# Altium project PPC_notebook_electrical_schematics_v0.6.PrjPcb (part 2 of 10)

## Sheet 07 SYS.SchDoc
size 420 x 297 mm
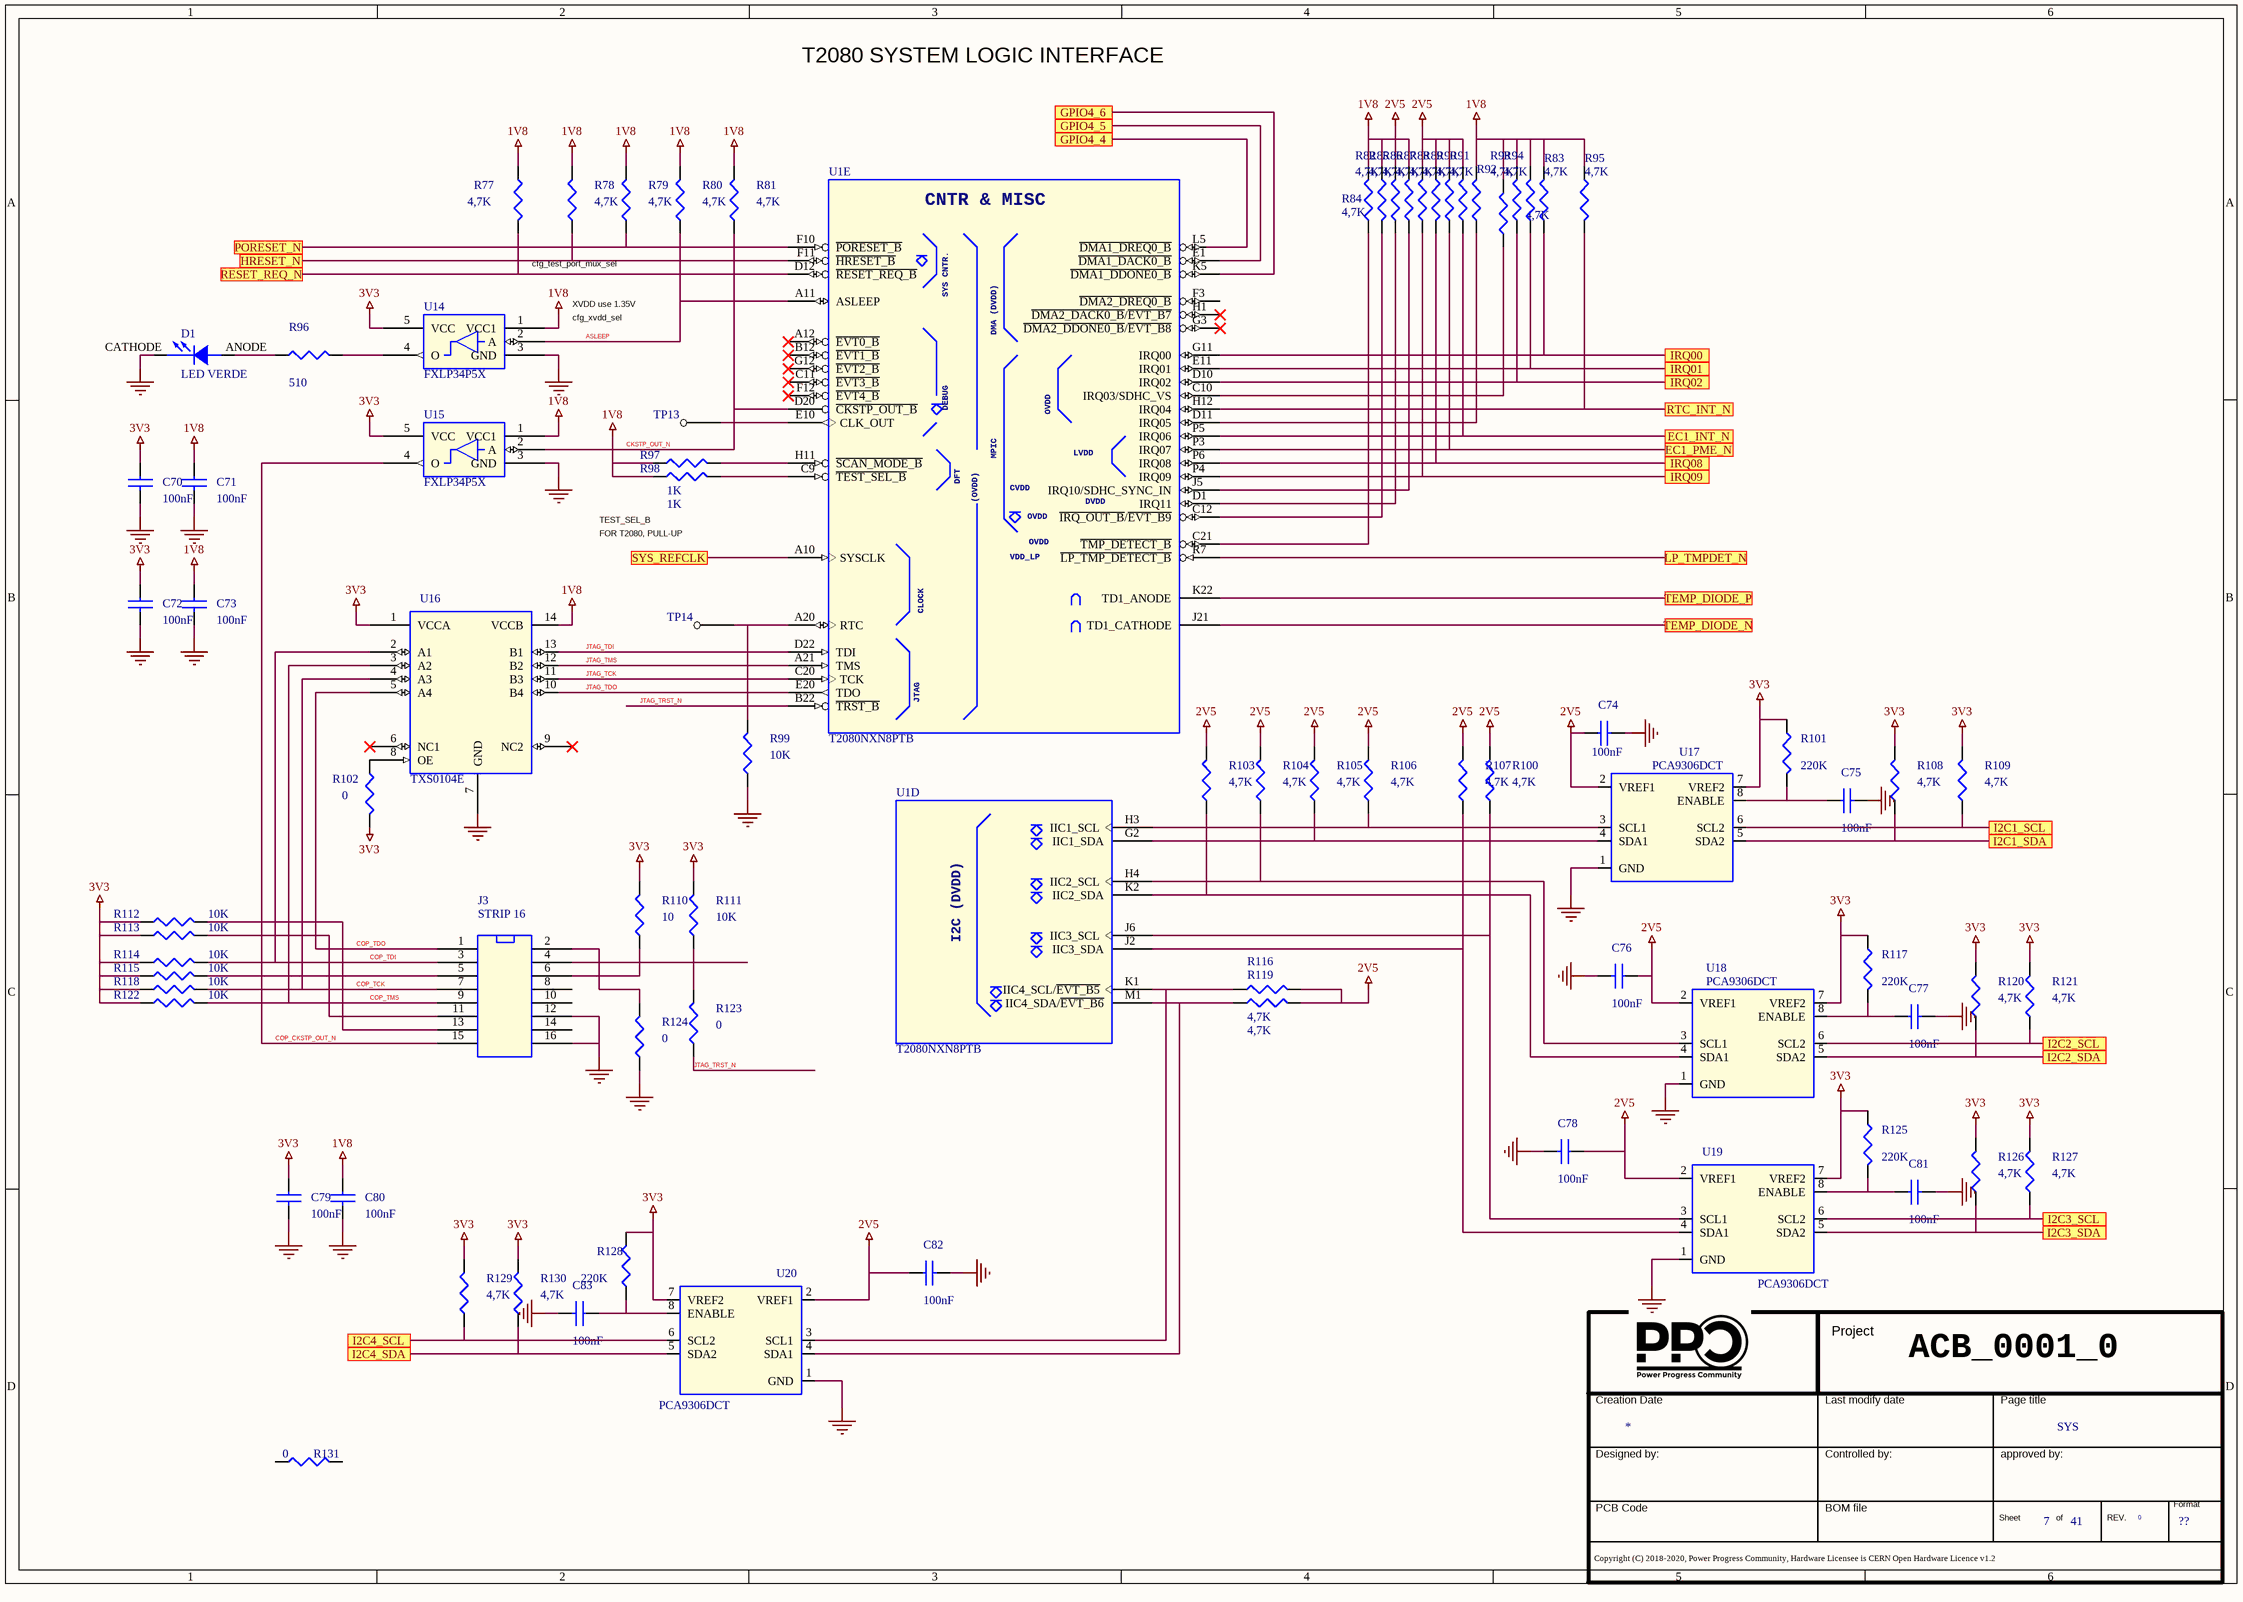
[diagram p15: 07 SYS.SchDoc]

### Parts
(Parts that share a designator on the sheet are numbered #1, #2 ... from top to bottom, then left to right.)
*#8  Doc: SYS  Page Count: 41  Page Number: 7  Page Size: ??  RevCode: 0  (hidden comment: Title_block_PPC)  (graphical)
C70  100nF  [SMD_0402]
C71  100nF  [SMD_0402]
C72  100nF  [SMD_0402]
C73  100nF  [SMD_0402]
C74  100nF  [SMD_0402]
C75  100nF  [SMD_0402]
C76  100nF  [SMD_0402]
C77  100nF  [SMD_0402]
C78  100nF  [SMD_0402]
C79  100nF  [SMD_0402]
C80  100nF  [SMD_0402]
C81  100nF  [SMD_0402]
C82  100nF  [SMD_0402]
C83  100nF  [SMD_0402]
D1  LED VERDE  [led_0603]
J3  STRIP 16  [SMD_2X50_P=0.635mm]
R77  4,7K  [SMD_0402]
R78  4,7K  [SMD_0402]
R79  4,7K  [SMD_0402]
R80  4,7K  [SMD_0402]
R81  4,7K  [SMD_0402]
R82  4,7K  [SMD_0402]
R83  4,7K  [SMD_0402]
R84  4,7K  [SMD_0402]
R85  4,7K  [SMD_0402]
R86  4,7K  [SMD_0402]
R87  4,7K  [SMD_0402]
R88  4,7K  [SMD_0402]
R89  4,7K  [SMD_0402]
R90  4,7K  [SMD_0402]
R91  4,7K  [SMD_0402]
R92  4,7K  [SMD_0402]
R93  4,7K  [SMD_0402]
R94  4,7K  [SMD_0402]
R95  4,7K  [SMD_0402]
R96  510  [SMD_0402]
R97  1K  [SMD_0402]
R98  1K  [SMD_0402]
R99  10K  [SMD_0402]
R100  4,7K  [SMD_0402]
R101  220K  [SMD_0402]
R102  0  [SMD_0402]
R103  4,7K  [SMD_0402]
R104  4,7K  [SMD_0402]
R105  4,7K  [SMD_0402]
R106  4,7K  [SMD_0402]
R107  4,7K  [SMD_0402]
R108  4,7K  [SMD_0402]
R109  4,7K  [SMD_0402]
R110  10  [SMD_0402]
R111  10K  [SMD_0402]
R112  10K  [SMD_0402]
R113  10K  [SMD_0402]
R114  10K  [SMD_0402]
R115  10K  [SMD_0402]
R116  4,7K  [SMD_0402]
R117  220K  [SMD_0402]
R118  10K  [SMD_0402]
R119  4,7K  [SMD_0402]
R120  4,7K  [SMD_0402]
R121  4,7K  [SMD_0402]
R122  10K  [SMD_0402]
R123  0  [SMD_0402]
R124  0  [SMD_0402]
R125  220K  [SMD_0402]
R126  4,7K  [SMD_0402]
R127  4,7K  [SMD_0402]
R128  220K  [SMD_0402]
R129  4,7K  [SMD_0402]
R130  4,7K  [SMD_0402]
R131  0  [SMD_0402]
TP13  tp  [tp]  (value not drawn)
TP14  tp  [tp]  (value not drawn)
U1  T2080NXN8PTB  [bga]  (parts D,E of 14)
U14  FXLP34P5X  [sc70_5]
U15  FXLP34P5X  [sc70_5]
U16  TXS0104E  [TSSOP14]
U17  PCA9306DCT  [8-SSOP]
U18  PCA9306DCT  [8-SSOP]
U19  PCA9306DCT  [8-SSOP]
U20  PCA9306DCT  [8-SSOP]

### Ports
EC1_INT_N, EC1_PME_N, GPIO4_4, GPIO4_5, GPIO4_6, HRESET_N, I2C1_SCL, I2C1_SDA, I2C2_SCL, I2C2_SDA, I2C3_SCL, I2C3_SDA, I2C4_SCL, I2C4_SDA, IRQ00, IRQ01, IRQ02, IRQ08, IRQ09, LP_TMPDET_N, PORESET_N, RESET_REQ_N, RTC_INT_N, SYS_REFCLK, TEMP_DIODE_N, TEMP_DIODE_P

### Nets
1V8: C71.1 C73.1 C80.1 R77.2 R78.2 R79.2 R80.2 R81.2 R82.1 R83.2 R84.2 R86.2 R91.2 R92.2 R93.2 R94.2 R95.1 R97.1 R98.1 U14.1(VCC1) U15.1(VCC1) U16.14(VCCB)
2V5: C74.1 C76.1 C78.1 C82.1 R85.2 R87.2 R88.1 R89.2 R90.2 R100.2 R103.2 R104.2 R105.2 R106.2 R107.1 R116.2 R119.2 U17.2(VREF1) U18.2(VREF1) U19.2(VREF1) U20.2(VREF1)
3V3: C70.1 C72.1 C79.1 R101.1 R102.1 R108.2 R109.2 R110.2 R111.2 R112.1 R113.1 R114.1 R115.1 R117.1 R118.1 R120.2 R121.2 R122.1 R125.1 R126.2 R127.2 R128.1 R129.1 R130.1 U14.5(VCC) U15.5(VCC) U16.1(VCCA) U17.7(VREF2) U18.7(VREF2) U19.7(VREF2) U20.7(VREF2)
GND: C70.2 C71.2 C72.2 C73.2 C74.2 C75.2 C76.2 C77.2 C78.2 C79.2 C80.2 C81.2 C82.2 C83.2 D1.CATHODE J3.12 J3.16 R99.1 R124.1 U14.3(GND) U15.3(GND) U16.7(GND) U17.1(GND) U18.1(GND) U19.1(GND) U20.1(GND)
ASLEEP: R80.1 U1.A11(ASLEEP) U14.2(A)
CKSTP_OUT_N: R81.1 U1.D20(~{CKSTP_OUT_B}) U15.2(A)
COP_CKSTP_OUT_N: J3.15 U15.4(O)
COP_TCK: J3.7 R118.2 U16.4(A3)
COP_TDI: J3.3 R114.2 U16.2(A1)
COP_TDO: J3.1 U16.5(A4)
COP_TMS: J3.9 R122.2 U16.3(A2)
JTAG_TCK: U1.C20(TCK) U16.11(B3)
JTAG_TDI: U1.D22(TDI) U16.13(B1)
JTAG_TDO: U1.E20(TDO) U16.10(B4)
JTAG_TMS: U1.A21(TMS) U16.12(B2)
JTAG_TRST_N: R123.1 U1.B22(~{TRST_B})
NetC75_1: C75.1 R101.2 U17.8(ENABLE)
NetC77_1: C77.1 R117.2 U18.8(ENABLE)
NetC81_1: C81.1 R125.2 U19.8(ENABLE)
NetC83_1: C83.1 R128.2 U20.8(ENABLE)
NetD1_ANODE: D1.ANODE R96.1
NetJ3_2: J3.2 R124.2
NetJ3_4: J3.4 R111.1 R123.2
NetJ3_5: J3.5 J3.11 R113.2 R115.2
NetJ3_6: J3.6 R110.1
NetJ3_13: J3.13 R112.2
NetJ30_2: U1.R7(~{LP_TMP_DETECT_B}) ; port LP_TMPDET_N
NetR77_1: R77.1 U1.D12(~{RESET_REQ_B}) ; port RESET_REQ_N
NetR78_1: R78.1 U1.F11(~{HRESET_B}) ; port HRESET_N
NetR79_1: R79.1 U1.F10(~{PORESET_B}) ; port PORESET_N
NetR82_2: R82.2 U1.C12(~{IRQ_OUT_B}/~{EVT_B9})
NetR83_1: R83.1 U1.G11(IRQ00) ; port IRQ00
NetR84_1: R84.1 U1.C21(~{TMP_DETECT_B})
NetR85_1: R85.1 U1.D1(IRQ11)
NetR86_1: R86.1 U1.J5(IRQ10/SDHC_SYNC_IN)
NetR87_1: R87.1 U1.P4(IRQ09) ; port IRQ09
NetR88_2: R88.2 U1.P6(IRQ08) ; port IRQ08
NetR89_1: R89.1 U1.P3(IRQ07) ; port EC1_PME_N
NetR90_1: R90.1 U1.P5(IRQ06) ; port EC1_INT_N
NetR91_1: R91.1 U1.D11(IRQ05)
NetR92_1: R92.1 U1.C10(IRQ03/SDHC_VS)
NetR93_1: R93.1 U1.D10(IRQ02) ; port IRQ02
NetR94_1: R94.1 U1.E11(IRQ01) ; port IRQ01
NetR95_2: R95.2 U1.H12(IRQ04) ; port RTC_INT_N
NetR96_2: R96.2 U14.4(O)
NetR97_2: R97.2 U1.H11(~{SCAN_MODE_B})
NetR98_2: R98.2 U1.C9(~{TEST_SEL_B})
NetR99_2: R99.2 TP14.1(TP) U1.A20(RTC)
NetR100_1: R100.1 U1.J6(IIC3_SCL) U19.3(SCL1)
NetR102_2: R102.2 U16.8(OE)
NetR103_1: R103.1 U1.K2(IIC2_SDA) U18.4(SDA1)
NetR104_1: R104.1 U1.H4(IIC2_SCL) U18.3(SCL1)
NetR105_1: R105.1 U1.G2(IIC1_SDA) U17.4(SDA1)
NetR106_1: R106.1 U1.H3(IIC1_SCL) U17.3(SCL1)
NetR107_2: R107.2 U1.J2(IIC3_SDA) U19.4(SDA1)
NetR108_1: R108.1 U17.5(SDA2) ; port I2C1_SDA
NetR109_1: R109.1 U17.6(SCL2) ; port I2C1_SCL
NetR116_1: R116.1 U1.K1(IIC4_SCL/~{EVT_B5}) U20.3(SCL1)
NetR119_1: R119.1 U1.M1(IIC4_SDA/~{EVT_B6}) U20.4(SDA1)
NetR120_1: R120.1 U18.5(SDA2) ; port I2C2_SDA
NetR121_1: R121.1 U18.6(SCL2) ; port I2C2_SCL
NetR126_1: R126.1 U19.5(SDA2) ; port I2C3_SDA
NetR127_1: R127.1 U19.6(SCL2) ; port I2C3_SCL
NetR129_2: R129.2 U20.6(SCL2) ; port I2C4_SCL
NetR130_2: R130.2 U20.5(SDA2) ; port I2C4_SDA
NetR261_1: U1.K22(TD1_ANODE) ; port TEMP_DIODE_P
NetR264_1: U1.J21(TD1_CATHODE) ; port TEMP_DIODE_N
NetR275_1: U1.K5(~{DMA1_DDONE0_B}) ; port GPIO4_6
NetR277_1: U1.E1(~{DMA1_DACK0_B}) ; port GPIO4_5
NetR320_2: U1.L5(~{DMA1_DREQ0_B}) ; port GPIO4_4
NetR703_2: U1.A10(SYSCLK) ; port SYS_REFCLK
NetTP13_1: TP13.1(TP) U1.E10(CLK_OUT)

Not connected (* = marked no-connect by the designer): J3 8 10 14; R131 1 2; U1 A12(~{EVT0_B})* B12(~{EVT1_B})* C11(~{EVT3_B})* F3(~{DMA2_DREQ0_B}) F12(~{EVT4_B})* G3(~{DMA2_DDONE0_B}/~{EVT_B8})* G12(~{EVT2_B})* H1(~{DMA2_DACK0_B}/~{EVT_B7})*; U16 6(NC1)* 9(NC2)*

### Notes on the sheet
- T2080 SYSTEM LOGIC INTERFACE
- cfg_test_port_mux_sel
- cfg_xvdd_sel
- XVDD use 1.35V
- TEST_SEL_B
- FOR T2080, PULL-UP
- ACB_0001_0
- (in symbol T2080, part D) I2C (DVDD)
- (in symbol T2080, part E) CNTR & MISC; SYS CNTR.; DMA (DVDD); DEBUG; OVDD; MPIC; LVDD; DFT; CVDD; (OVDD); DVDD; CLOCK; JTAG

### Library data of the parts
*#8 = Title_block_PPC: Title: T2080PCIe; Schematic Page Count: 45; Schematic Page Number: 8; Author: MICETEK; Page Create Date: March  8, 1995; Page Title: ?; Page Modify Date: *
C70-C73 = CAP NP_Dup2: COND.CER. 100NF 50V 0402 X7R SMD; Manufacturer Part Number 1: CGA2B3X7R1H104M050BD; Manufacturer 1: TDK; Part Number: PASSIVE_24; RSM: RC0402; PCB Footprint: SMD_0402; Part Type: Capacitors\Ceramic\SMD\0402
C74-C83 = CAP NP_Dup2: COND.CER. 100NF 50V 0402 X7R SMD; Part Number: PASSIVE_24; Manufacturer 1: TDK; Manufacturer Part Number 1: CGA2B3X7R1H104M050BD; RSM: RC0402; Part Type: Capacitors\Ceramic\SMD\0402; PCB Footprint: SMD_0402
D1 = LED_1: LED CHIPLED VERDE 40mcd 570nm; Manufacturer Part Number 1: 598-8070-107F; Manufacturer 1: DIALIGHT; Part Number: DISCRETE_31; PCB Footprint: SMD_0603; RSM: LED0603-AK; Distributor 1: MOUSER(645-598-8070-107F); Part Type: Diodes\LED; TYPE: LED
J3 = HEADER_8X2: STRIP MASCH.2x8P CS.p=2.0mm SMT; PART NUMBER: CONNECTORS_517; Manufacturer Part Number 1: TMMH-108-01-L-DV; Manufacturer 1: Samtec; RSM: SAMTEC-TMMH-108-01-L-DV-16; PCB Footprint: 8X2P=2.0mm SMT; Distributor 1: FARNELL(2024017); Part Type: Strip\Terminal
R77-R94 R100 R103-R109 R116 R119-R121 R126 R127 R129 R130 = R_Dup5: RESIS.CHIP 4,7K 5% 0402 SMD; Part Number: PASSIVE_861; Manufacturer 1: ROYAL OHM; RSM: RC0402; Part Type: Resistors\Fixed\SMD\0402\5%; Manufacturer Part Number 1: RESIS.CHIP 4,7K 5% 0402 SMD; PCB Footprint: SMD_0402
R95 = R_Dup5: RESIS.CHIP 4,7K 5% 0402 SMD; Manufacturer 1: ROYAL OHM; Part Number: PASSIVE_861; RSM: RC0402; Manufacturer Part Number 1: RESIS.CHIP 4,7K 5% 0402 SMD; Part Type: Resistors\Fixed\SMD\0402\5%; PCB Footprint: SMD_0402
R96 = R_Dup5: RESIS.CHIP 510R 1% 0402 SMD; Part Number: PASSIVE_749; Manufacturer 1: ROYAL OHM; RSM: RC0402; Part Type: Resistors\Fixed\SMD\0402\1%; Manufacturer Part Number 1: RESIS.CHIP 510R 1% 0402 SMD; PCB Footprint: SMD_0402
R97 R98 = R_Dup5: RESIS.CHIP 1K 1% 0402 SMD; Part Number: PASSIVE_628; Manufacturer 1: ROYAL OHM; RSM: RC0402; PCB Footprint: SMD_0402; Part Type: Resistors\Fixed\SMD\0402\1%; Manufacturer Part Number 1: RESIS.CHIP 1K 1% 0402 SMD
R99 R111-R113 R118 R122 = R_Dup5: RESIS.CHIP 10K 1% 0402 SMD; Part Number: PASSIVE_584; Manufacturer 1: ROYAL OHM; RSM: RC0402; PCB Footprint: SMD_0402; Part Type: Resistors\Fixed\SMD\0402\1%; Manufacturer Part Number 1: RESIS.CHIP 10K 1% 0402 SMD
R101 R117 R128 = R_Dup5: RESIS.CHIP 220K 5% 0402 SMD; Manufacturer 1: ROYAL OHM; Part Number: PASSIVE_842; RSM: RC0402; Distributor 1: CAMEL ELETTRONICA SRL  #; Manufacturer Part Number 1: RESIS.CHIP 220K 5% 0402 SMD; Part Type: Resistors\Fixed\SMD\0402\5%; PCB Footprint: SMD_0402
R102 R123 R124 = R_Dup5: RESIS.CHIP 0R 5% 0402 SMD; Part Number: PASSIVE_805; Manufacturer 1: ROYAL OHM; RSM: RC0402; Part Type: Resistors\Fixed\SMD\0402\5%; Manufacturer Part Number 1: RESIS.CHIP 0R 5% 0402 SMD; PCB Footprint: SMD_0402
R110 = R_Dup5: RESIS.CHIP 10R 5% 0402 SMD; Part Number: PASSIVE_811; Manufacturer 1: ROYAL OHM; RSM: RC0402; Part Type: Resistors\Fixed\SMD\0402\5%; Manufacturer Part Number 1: RESIS.CHIP 10R 5% 0402 SMD; PCB Footprint: SMD_0402
R114 R115 = R_Dup5: RESIS.CHIP 10K 1% 0402 SMD; Manufacturer 1: ROYAL OHM; Part Number: PASSIVE_584; RSM: RC0402; PCB Footprint: SMD_0402; Manufacturer Part Number 1: RESIS.CHIP 10K 1% 0402 SMD; Part Type: Resistors\Fixed\SMD\0402\1%
R125 = R_Dup5: RESIS.CHIP 220K 5% 0402 SMD; Part Number: PASSIVE_842; Manufacturer 1: ROYAL OHM; RSM: RC0402; Part Type: Resistors\Fixed\SMD\0402\5%; Manufacturer Part Number 1: RESIS.CHIP 220K 5% 0402 SMD; Distributor 1: CAMEL ELETTRONICA SRL  #; PCB Footprint: SMD_0402
R131 = R_Dup8: RESIS.CHIP 0R 5% 0402 SMD; Manufacturer 1: ROYAL OHM; Part Number: PASSIVE_805; RSM: RC0402; Distributor 1: CAMEL ELETTRONICA SRL  #; Manufacturer Part Number 1: RESIS.CHIP 0R 5% 0402 SMD; Part Type: Resistors\Fixed\SMD\0402\5%; PCB Footprint: SMD_0402
TP13 TP14 = TP: RSM: AE-TESTPOINT; PCB Footprint: tp
U1 = T2080: QRIQ MPU 1.87GT/s DDR3/3L 4x10GE; Part Number: MICROPROCESSOR_65; Manufacturer 1: NXP; Vendor: Freescale; PCB Footprint: BGA896; RSM: PBGA896-0_8MM-25X25; TYPE: IC; MPN: T2080; Part Type: 32 BIT; Manufacturer Part Number 1: T2080NXN8PTB; Distributor 1: MOUSER(841-T2080NXN8PTB)
U14 U15 = FXLP34P5X: IC TRANSLATOR DUAL 4BIT 16-DQFN; Part Number: LOGIC_360; Manufacturer 1: ON Semi; Manufacturer Part Number 1: FXL4TD245BQX; Vendor: FAIRCHILD; PCB Footprint: sc70-5; RSM: SC-70-5; TYPE: IC; MPN: FXLP34P5X; Part Type: TRANSLATOR\FXL; Distributor 1: DIGIKEY (FXL4TD245BQXCT-ND)
U16 = TXS0104E: BIDIRECTIONAL VOLTAGE-LEVEL TRANSLATOR; Manufacturer Part Number 1: TXS0104EPWR; Manufacturer 1: TEXAS; Part Number: LOGIC_264; RSM: TSSOP-14; Distributor 1: TI.COM; Part Type: TRANSLATOR; PCB Footprint: TSSOP14
U17 U18 U20 = PCA9306DCUT: IC VOLT-LEVEL TRANSLATOR; Manufacturer 1: TEXAS; Part Number: LOGIC_267; RSM: SSOP-8; Distributor 1: DIGIKEY(296-18509-1-ND); Manufacturer Part Number 1: PCA9306DCT; Part Type: TRANSLATOR\I2C; PCB Footprint: 8-SSOP
U19 = PCA9306DCUT: IC VOLT-LEVEL TRANSLATOR; Part Number: LOGIC_267; Manufacturer 1: TEXAS; RSM: SSOP-8; Part Type: TRANSLATOR\I2C; Manufacturer Part Number 1: PCA9306DCT; Distributor 1: DIGIKEY(296-18509-1-ND); PCB Footprint: 8-SSOP

## Sheet 08 EC&SD.SchDoc
size 420 x 297 mm
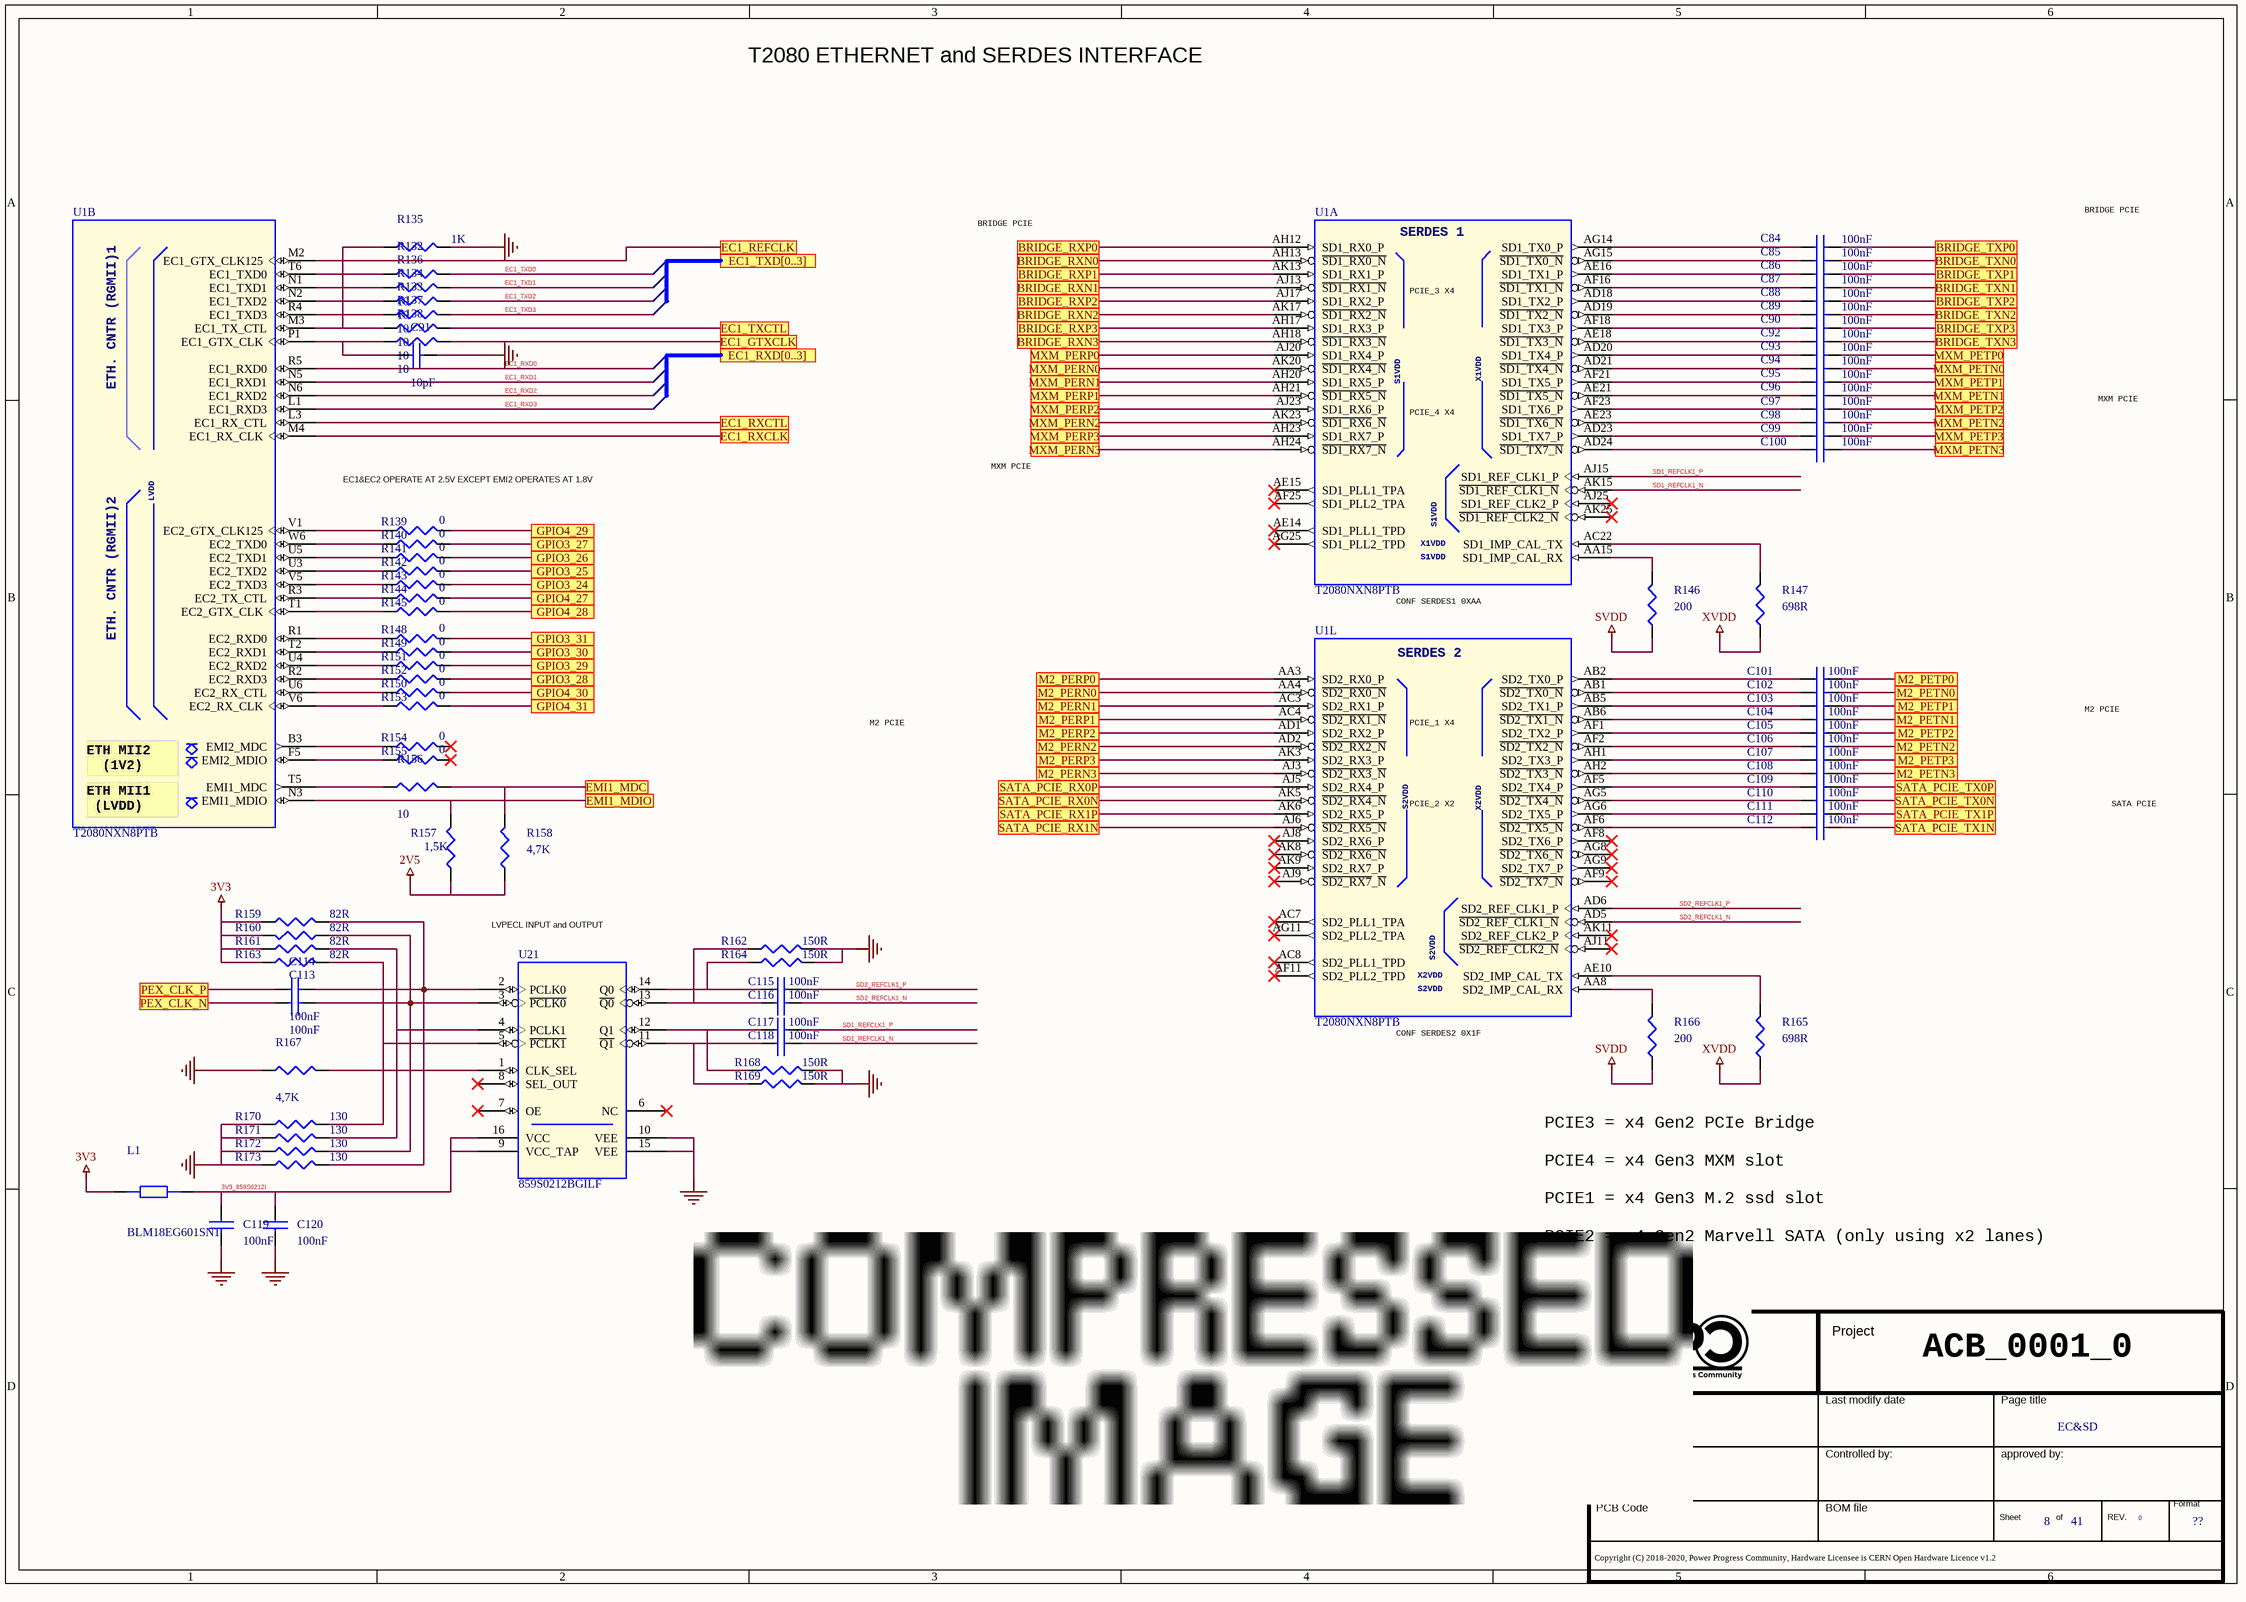
[diagram p16: 08 EC&SD.SchDoc]

### Parts
(Parts that share a designator on the sheet are numbered #1, #2 ... from top to bottom, then left to right.)
*#9  Doc: EC&SD  Page Count: 41  Page Number: 8  Page Size: ??  RevCode: 0  (hidden comment: Title_block_PPC)  (graphical)
C84  100nF  [SMD_0201]
C85  100nF  [SMD_0201]
C86  100nF  [SMD_0201]
C87  100nF  [SMD_0201]
C88  100nF  [SMD_0201]
C89  100nF  [SMD_0201]
C90  100nF  [SMD_0201]
C91  10pF  [SMD_0402]
C92  100nF  [SMD_0201]
C93  100nF  [SMD_0201]
C94  100nF  [SMD_0201]
C95  100nF  [SMD_0201]
C96  100nF  [SMD_0201]
C97  100nF  [SMD_0201]
C98  100nF  [SMD_0201]
C99  100nF  [SMD_0201]
C100  100nF  [SMD_0201]
C101  100nF  [SMD_0201]
C102  100nF  [SMD_0201]
C103  100nF  [SMD_0201]
C104  100nF  [SMD_0201]
C105  100nF  [SMD_0201]
C106  100nF  [SMD_0201]
C107  100nF  [SMD_0201]
C108  100nF  [SMD_0201]
C109  100nF  [SMD_0201]
C110  100nF  [SMD_0201]
C111  100nF  [SMD_0201]
C112  100nF  [SMD_0201]
C113  100nF  [SMD_0402]
C114  100nF  [SMD_0402]
C115  100nF  [SMD_0402]
C116  100nF  [SMD_0402]
C117  100nF  [SMD_0402]
C118  100nF  [SMD_0402]
C119  100nF  [SMD_0402]
C120  100nF  [SMD_0402]
L1  BLM18EG601SN1  [SMD_0603]
R132  10  [SMD_0402]
R133  10  [SMD_0402]
R134  10  [SMD_0402]
R135  1K  [SMD_0402]
R136  10  [SMD_0402]
R137  10  [SMD_0402]
R138  10  [SMD_0402]
R139  0  [SMD_0402]
R140  0  [SMD_0402]
R141  0  [SMD_0402]
R142  0  [SMD_0402]
R143  0  [SMD_0402]
R144  0  [SMD_0402]
R145  0  [SMD_0402]
R146  200  [SMD_0402]
R147  698R  [SMD_0402]
R148  0  [SMD_0402]
R149  0  [SMD_0402]
R150  0  [SMD_0402]
R151  0  [SMD_0402]
R152  0  [SMD_0402]
R153  0  [SMD_0402]
R154  0  [SMD_0402]
R155  0  [SMD_0402]
R156  10  [SMD_0402]
R157  1,5K  [SMD_0402]
R158  4,7K  [SMD_0402]
R159  82R  [SMD_0402]
R160  82R  [SMD_0402]
R161  82R  [SMD_0402]
R162  150R  [SMD_0402]
R163  82R  [SMD_0402]
R164  150R  [SMD_0402]
R165  698R  [SMD_0402]
R166  200  [SMD_0402]
R167  4,7K  [SMD_0402]
R168  150R  [SMD_0402]
R169  150R  [SMD_0402]
R170  130  [SMD_0402]
R171  130  [SMD_0402]
R172  130  [SMD_0402]
R173  130  [SMD_0402]
U1  T2080NXN8PTB  [bga]  (parts A,B,L of 14)
U21  859S0212BGILF  [tssop_16]

### Ports
BRIDGE_RXN0, BRIDGE_RXN1, BRIDGE_RXN2, BRIDGE_RXN3, BRIDGE_RXP0, BRIDGE_RXP1, BRIDGE_RXP2, BRIDGE_RXP3, BRIDGE_TXN0, BRIDGE_TXN1, BRIDGE_TXN2, BRIDGE_TXN3, BRIDGE_TXP0, BRIDGE_TXP1, BRIDGE_TXP2, BRIDGE_TXP3, EC1_GTXCLK, EC1_REFCLK, EC1_RXCLK, EC1_RXCTL, EC1_RXD[0..3], EC1_TXCTL, EC1_TXD[0..3], EMI1_MDC, EMI1_MDIO, GPIO3_24, GPIO3_25, GPIO3_26, GPIO3_27, GPIO3_28, GPIO3_29, GPIO3_30, GPIO3_31, GPIO4_27, GPIO4_28, GPIO4_29, GPIO4_30, GPIO4_31, M2_PERN0, M2_PERN1, M2_PERN2, M2_PERN3, M2_PERP0, M2_PERP1, M2_PERP2, M2_PERP3, M2_PETN0, M2_PETN1, M2_PETN2, M2_PETN3, M2_PETP0, M2_PETP1, M2_PETP2, M2_PETP3, MXM_PERN0, MXM_PERN1, MXM_PERN2, MXM_PERN3, MXM_PERP0, MXM_PERP1, MXM_PERP2, MXM_PERP3, MXM_PETN0, MXM_PETN1, MXM_PETN2, MXM_PETN3, MXM_PETP0, MXM_PETP1, MXM_PETP2, MXM_PETP3, PEX_CLK_N, PEX_CLK_P, SATA_PCIE_RX0N, SATA_PCIE_RX0P, SATA_PCIE_RX1N, SATA_PCIE_RX1P, SATA_PCIE_TX0N, SATA_PCIE_TX0P, SATA_PCIE_TX1N, SATA_PCIE_TX1P

### Nets
2V5: R157.1 R158.1
3V3: L1.1 R159.1 R160.2 R161.1 R163.1
GND: C91.2 C119.2 C120.2 R135.2 R162.2 R164.2 R167.1 R168.2 R169.2 R170.1 R171.1 R172.1 R173.1 U21.10(VEE) U21.15(VEE)
SVDD: R146.1 R166.1
XVDD: R147.1 R165.1
3V3_859S0212I: C119.1 C120.1 L1.2 U21.9(VCC_TAP) U21.16(VCC)
EC1_RXD0: U1.R5(EC1_RXD0)
EC1_RXD1: U1.N5(EC1_RXD1)
EC1_RXD2: U1.N6(EC1_RXD2)
EC1_RXD3: U1.L1(EC1_RXD3)
EC1_TXD0: R132.2
EC1_TXD1: R136.2
EC1_TXD2: R134.2
EC1_TXD3: R133.2
PRX_0N: U1.AK5(~{SD2_RX4_N}) ; port SATA_PCIE_RX0N
PRX_0P: U1.AJ5(SD2_RX4_P) ; port SATA_PCIE_RX0P
PRX_1N: U1.AJ6(~{SD2_RX5_N}) ; port SATA_PCIE_RX1N
PRX_1P: U1.AK6(SD2_RX5_P) ; port SATA_PCIE_RX1P
SD1_REFCLK1_N: C118.2 U1.AK15(~{SD1_REF_CLK1_N})
SD1_REFCLK1_P: C117.2 U1.AJ15(SD1_REF_CLK1_P)
SD2_REFCLK1_N: C116.2 U1.AD5(~{SD2_REF_CLK1_N})
SD2_REFCLK1_P: C115.2 U1.AD6(SD2_REF_CLK1_P)
NetC84_1: C84.1 U1.AG14(SD1_TX0_P)
NetC84_2: C84.2 ; port BRIDGE_TXP0
NetC85_1: C85.1 U1.AG15(~{SD1_TX0_N})
NetC85_2: C85.2 ; port BRIDGE_TXN0
NetC86_1: C86.1 U1.AE16(SD1_TX1_P)
NetC86_2: C86.2 ; port BRIDGE_TXP1
NetC87_1: C87.1 U1.AF16(~{SD1_TX1_N})
NetC87_2: C87.2 ; port BRIDGE_TXN1
NetC88_1: C88.1 U1.AD18(SD1_TX2_P)
NetC88_2: C88.2 ; port BRIDGE_TXP2
NetC89_1: C89.1 U1.AD19(~{SD1_TX2_N})
NetC89_2: C89.2 ; port BRIDGE_TXN2
NetC90_1: C90.1 U1.AF18(SD1_TX3_P)
NetC90_2: C90.2 ; port BRIDGE_TXP3
NetC91_1: C91.1 R138.1 U1.P1(EC1_GTX_CLK)
NetC92_1: C92.1 U1.AE18(~{SD1_TX3_N})
NetC92_2: C92.2 ; port BRIDGE_TXN3
NetC93_1: C93.1 U1.AD20(SD1_TX4_P)
NetC93_2: C93.2 ; port MXM_PETP0
NetC94_1: C94.1 U1.AD21(~{SD1_TX4_N})
NetC94_2: C94.2 ; port MXM_PETN0
NetC95_1: C95.1 U1.AF21(SD1_TX5_P)
NetC95_2: C95.2 ; port MXM_PETP1
NetC96_1: C96.1 U1.AE21(~{SD1_TX5_N})
NetC96_2: C96.2 ; port MXM_PETN1
NetC97_1: C97.1 U1.AF23(SD1_TX6_P)
NetC97_2: C97.2 ; port MXM_PETP2
NetC98_1: C98.1 U1.AE23(~{SD1_TX6_N})
NetC98_2: C98.2 ; port MXM_PETN2
NetC99_1: C99.1 U1.AD23(SD1_TX7_P)
NetC99_2: C99.2 ; port MXM_PETP3
NetC100_1: C100.1 U1.AD24(~{SD1_TX7_N})
NetC100_2: C100.2 ; port MXM_PETN3
NetC101_1: C101.1 U1.AB2(SD2_TX0_P)
NetC101_2: C101.2 ; port M2_PETP0
NetC102_1: C102.1 U1.AB1(~{SD2_TX0_N})
NetC102_2: C102.2 ; port M2_PETN0
NetC103_1: C103.1 U1.AB5(SD2_TX1_P)
NetC103_2: C103.2 ; port M2_PETP1
NetC104_1: C104.1 U1.AB6(~{SD2_TX1_N})
NetC104_2: C104.2 ; port M2_PETN1
NetC105_1: C105.1 U1.AF1(SD2_TX2_P)
NetC105_2: C105.2 ; port M2_PETP2
NetC106_1: C106.1 U1.AF2(~{SD2_TX2_N})
NetC106_2: C106.2 ; port M2_PETN2
NetC107_1: C107.1 U1.AH1(SD2_TX3_P)
NetC107_2: C107.2 ; port M2_PETP3
NetC108_1: C108.1 U1.AH2(~{SD2_TX3_N})
NetC108_2: C108.2 ; port M2_PETN3
NetC109_1: C109.1 U1.AF5(SD2_TX4_P)
NetC109_2: C109.2 ; port SATA_PCIE_TX0P
NetC110_1: C110.1 U1.AG5(~{SD2_TX4_N})
NetC110_2: C110.2 ; port SATA_PCIE_TX0N
NetC111_1: C111.1 U1.AG6(SD2_TX5_P)
NetC111_2: C111.2 ; port SATA_PCIE_TX1P
NetC112_1: C112.1 U1.AF6(~{SD2_TX5_N})
NetC112_2: C112.2 ; port SATA_PCIE_TX1N
NetC113_1: C113.1 ; port PEX_CLK_N
NetC113_2: C113.2 R160.1 R172.2 U21.3(~{PCLK0})
NetC114_1: C114.1 ; port PEX_CLK_P
NetC114_2: C114.2 R159.2 R173.2 U21.2(PCLK0)
NetC115_1: C115.1 R164.1 U21.14(Q0)
NetC116_1: C116.1 R162.1 U21.13(~{Q0})
NetC117_1: C117.1 R168.1 U21.12(Q1)
NetC118_1: C118.1 R169.1 U21.11(~{Q1})
NetC500_1: U1.AA3(SD2_RX0_P) ; port M2_PERP0
NetC501_1: U1.AA4(~{SD2_RX0_N}) ; port M2_PERN0
NetC509_1: U1.AC4(~{SD2_RX1_N}) ; port M2_PERP1
NetC510_1: U1.AC3(SD2_RX1_P) ; port M2_PERN1
NetC511_1: U1.AD1(SD2_RX2_P) ; port M2_PERP2
NetC512_1: U1.AD2(~{SD2_RX2_N}) ; port M2_PERN2
NetC513_1: U1.AK3(SD2_RX3_P) ; port M2_PERP3
NetC514_1: U1.AJ3(~{SD2_RX3}_~{N}) ; port M2_PERN3
NetC580_2: U1.AH17(SD1_RX3_P) ; port BRIDGE_RXP3
NetC581_2: U1.AJ17(SD1_RX2_P) ; port BRIDGE_RXP2
NetC582_2: U1.AH18(~{SD1_RX3_N}) ; port BRIDGE_RXN3
NetC583_2: U1.AK17(~{SD1_RX2_N}) ; port BRIDGE_RXN2
NetC584_2: U1.AK13(SD1_RX1_P) ; port BRIDGE_RXP1
NetC585_2: U1.AH12(SD1_RX0_P) ; port BRIDGE_RXP0
NetC586_2: U1.AJ13(~{SD1_RX1_N}) ; port BRIDGE_RXN1
NetC587_2: U1.AH13(~{SD1_RX0_N}) ; port BRIDGE_RXN0
NetC703_1: U1.AH24(~{SD1_RX7_N}) ; port MXM_PERN3
NetC704_1: U1.AH23(SD1_RX7_P) ; port MXM_PERP3
NetC705_1: U1.AK23(~{SD1_RX6}_~{N}) ; port MXM_PERN2
NetC706_1: U1.AJ23(SD1_RX6_P) ; port MXM_PERP2
NetC707_1: U1.AH20(SD1_RX5_P) ; port MXM_PERN1
NetC708_1: U1.AH21(~{SD1_RX5_N}) ; port MXM_PERP1
NetC709_1: U1.AK20(~{SD1_RX4_N}) ; port MXM_PERN0
NetC710_1: U1.AJ20(SD1_RX4_P) ; port MXM_PERP0
NetR132_1: R132.1 U1.T6(EC1_TXD0)
NetR133_1: R133.1 U1.R4(EC1_TXD3)
NetR134_1: R134.1 U1.N2(EC1_TXD2)
NetR135_1: R135.1 R137.1 U1.M3(EC1_TX_CTL)
NetR136_1: R136.1 U1.N1(EC1_TXD1)
NetR137_2: R137.2 ; port EC1_TXCTL
NetR138_2: R138.2 ; port EC1_GTXCLK
NetR139_1: R139.1 U1.V1(EC2_GTX_CLK125)
NetR139_2: R139.2 ; port GPIO4_29
NetR140_1: R140.1 U1.W6(EC2_TXD0)
NetR140_2: R140.2 ; port GPIO3_27
NetR141_1: R141.1 U1.U5(EC2_TXD1)
NetR141_2: R141.2 ; port GPIO3_26
NetR142_1: R142.1 U1.U3(EC2_TXD2)
NetR142_2: R142.2 ; port GPIO3_25
NetR143_1: R143.1 U1.V5(EC2_TXD3)
NetR143_2: R143.2 ; port GPIO3_24
NetR144_1: R144.1 U1.R3(EC2_TX_CTL)
NetR144_2: R144.2 ; port GPIO4_27
NetR145_1: R145.1 U1.T1(EC2_GTX_CLK)
NetR145_2: R145.2 ; port GPIO4_28
NetR146_2: R146.2 U1.AA15(SD1_IMP_CAL_RX)
NetR147_2: R147.2 U1.AC22(SD1_IMP_CAL_TX)
NetR148_1: R148.1 U1.R1(EC2_RXD0)
NetR148_2: R148.2 ; port GPIO3_31
NetR149_1: R149.1 U1.T2(EC2_RXD1)
NetR149_2: R149.2 ; port GPIO3_30
NetR150_1: R150.1 U1.U6(EC2_RX_CTL)
NetR150_2: R150.2 ; port GPIO4_30
NetR151_1: R151.1 U1.U4(EC2_RXD2)
NetR151_2: R151.2 ; port GPIO3_29
NetR152_1: R152.1 U1.R2(EC2_RXD3)
NetR152_2: R152.2 ; port GPIO3_28
NetR153_1: R153.1 U1.V6(EC2_RX_CLK)
NetR153_2: R153.2 ; port GPIO4_31
NetR154_1: R154.1 U1.B3(EMI2_MDC)
NetR155_1: R155.1 U1.F5(EMI2_MDIO)
NetR156_1: R156.1 U1.T5(EMI1_MDC)
NetR156_2: R156.2 R158.2 ; port EMI1_MDC
NetR157_2: R157.2 U1.N3(EMI1_MDIO) ; port EMI1_MDIO
NetR161_2: R161.2 R171.2 U21.4(PCLK1)
NetR163_2: R163.2 R170.2 U21.5(~{PCLK1})
NetR165_2: R165.2 U1.AE10(SD2_IMP_CAL_TX)
NetR166_2: R166.2 U1.AA8(SD2_IMP_CAL_RX)
NetR167_2: R167.2 U21.1(CLK_SEL)
NetR381_2: U1.M2(EC1_GTX_CLK125) ; port EC1_REFCLK
NetR390_1: U1.M4(EC1_RX_CLK) ; port EC1_RXCLK
NetR391_1: U1.L3(EC1_RX_CTL) ; port EC1_RXCTL

Not connected (* = marked no-connect by the designer): R154 2*; R155 2*; U1 AC7(SD2_PLL1_TPA)* AC8(SD2_PLL1_TPD)* AE14(SD1_PLL1_TPD)* AE15(SD1_PLL1_TPA)* AF8(SD2_TX6_P)* AF9(~{SD2_TX7_N})* AF11(SD2_PLL2_TPD)* AF25(SD1_PLL2_TPA)* AG8(~{SD2_TX6_N})* AG9(SD2_TX7_P)* AG11(SD2_PLL2_TPA)* AG25(SD1_PLL2_TPD)* AJ8(SD2_RX6_P)* AJ9(~{SD2_RX7}_~{N})* AJ11(~{SD2_REF_CLK2_N})* AJ25(SD1_REF_CLK2_P)* AK8(~{SD2_RX6_N})* AK9(SD2_RX7_P)* AK11(SD2_REF_CLK2_P)* AK25(~{SD1_REF_CLK2_N})*; U21 6(NC)* 7(OE)* 8(SEL_OUT)*

### Notes on the sheet
- T2080 ETHERNET and SERDES INTERFACE
- BRIDGE PCIE
- (near U1) PCIE_3 X4
- (near U1) PCIE_4 X4
- MXM PCIE
- EC1&EC2 OPERATE AT 2.5V EXCEPT EMI2 OPERATES AT 1.8V
- (near U1) CONF SERDES1 0XAA
- M2 PCIE
- (near U1) PCIE_1 X4
- (near U1) PCIE_2 X2
- SATA PCIE
- LVPECL INPUT and OUTPUT
- (near U1) CONF SERDES2 0X1F
- PCIE3 = x4 Gen2 PCIe Bridge
  PCIE4 = x4 Gen3 MXM slot
  PCIE1 = x4 Gen3 M.2 ssd slot
  PCIE2 = x4 Gen2 Marvell SATA (only using x2 lanes)
- ACB_0001_0
- (in symbol T2080, part A) SERDES 1; S1VDD; X1VDD
- (in symbol T2080, part B) ETH. CNTR (RGMII)1; LVDD; ETH. CNTR (RGMII)2; ETH MII2 / (1V2); ETH MII1 / (LVDD)
- (in symbol T2080, part L) SERDES 2; S2VDD; X2VDD

### Library data of the parts
*#9 = Title_block_PPC: Title: T2080PCIe; Schematic Page Count: 45; Schematic Page Number: 9; Author: MICETEK; Page Create Date: March  8, 1995; Page Title: ?; Page Modify Date: *
C84-C90 C92-C100 C102-C104 C106 C108-C112 = CAP NP_Dup2: CAP CER 0.1UF 6.3V 20% X5R 0201; Manufacturer Part Number 1: C0603X5R0J104M030BC; Manufacturer 1: TDK; Part Number: PASSIVE_3; RSM: RC0201; Part Type: Capacitors\Ceramic\SMD\0201; PCB Footprint: SMD_0201
C91 = CAP NP_Dup2: COND.CER.10PF 50V 0402 NPO/COG SMD; Manufacturer Part Number 1: GRM1555C1H100JZ01D; Manufacturer 1: Murata; Part Number: PASSIVE_32; RSM: RC0402; PCB Footprint: SMD_0402; Part Type: Capacitors\Ceramic\SMD\0402
C101 C105 C107 = CAP NP_Dup2: CAP CER 0.1UF 6.3V 20% X5R 0201; Part Number: PASSIVE_3; Manufacturer 1: TDK; Manufacturer Part Number 1: C0603X5R0J104M030BC; RSM: RC0201; Part Type: Capacitors\Ceramic\SMD\0201; PCB Footprint: SMD_0201
C113-C120 = CAP NP_Dup2: as C74-C83 on sheet 07 SYS; Part Type: Capacitors\Ceramic\SMD\0402; PCB Footprint: SMD_0402
L1 = FERRITE_BEAD: FERRITE BEAD 600ohm 500mA 0603 SMD; Part Number: PASSIVE_377; Manufacturer 1: Murata; Manufacturer Part Number 1: BLM18EG601SN1 SMD; RSM: RC0603; PCB Footprint: SMD_0603; Part Type: Ferrite Beads\SMD\0603
R132-R134 R136-R138 R156 = R_Dup5: as R110 on sheet 07 SYS; PCB Footprint: SMD_0402; Part Type: Resistors\Fixed\SMD\0402\5%; Manufacturer Part Number 1: RESIS.CHIP 10R 5% 0402 SMD
R135 = R_Dup5: RESIS.CHIP 1K 1% 0402 SMD; Manufacturer 1: ROYAL OHM; Part Number: PASSIVE_628; RSM: RC0402; PCB Footprint: SMD_0402; Manufacturer Part Number 1: RESIS.CHIP 1K 1% 0402 SMD; Part Type: Resistors\Fixed\SMD\0402\1%
R139-R145 R154 R155 = R_Dup5: RESIS.CHIP 0R 5% 0402 SMD; Manufacturer 1: ROYAL OHM; Part Number: PASSIVE_805; RSM: RC0402; PCB Footprint: SMD_0402; Distributor 1: CAMEL ELETTRONICA SRL  #; Manufacturer Part Number 1: RESIS.CHIP 0R 5% 0402 SMD; Part Type: Resistors\Fixed\SMD\0402\5%
R146 R166 = R_Dup5: RES 200 OHM 1/10W 1% 0402 SMD; Part Number: PASSIVE_639; Manufacturer 1: PANASONIC; Manufacturer Part Number 1: ERJ-2RKF2000X; RSM: RC0402; PCB Footprint: SMD_0402; Part Type: Resistors\Fixed\SMD\0402\1%
R147 R165 = R_Dup5: RESIS.CHIP 698R 1% 0402 SMD; Part Number: PASSIVE_1458; Manufacturer 1: ROYAL OHM; RSM: RC0402; PCB Footprint: SMD_0402; Part Type: Resistors\Fixed\SMD\0402\1%; Manufacturer Part Number 1: RESIS.CHIP 698R 1% 0402 SMD
R148-R153 = R_Dup5: as R102 on sheet 07 SYS; PCB Footprint: SMD_0402; Part Type: Resistors\Fixed\SMD\0402\5%; Manufacturer Part Number 1: RESIS.CHIP 0R 5% 0402 SMD; Distributor 1: CAMEL ELETTRONICA SRL  #
R157 = R_Dup5: RES 1,5K OHM 1/10W 1% 0402 SMD; Part Number: PASSIVE_575; RSM: RC0402; PCB Footprint: SMD_0402; Part Type: Resistors\Fixed\SMD\0402\1%
R158 R167 = R_Dup5: as R77-R94 on sheet 07 SYS; PCB Footprint: SMD_0402; Part Type: Resistors\Fixed\SMD\0402\5%; Manufacturer Part Number 1: RESIS.CHIP 4,7K 5% 0402 SMD
R159-R161 R163 = R_Dup5: RESIS.CHIP 82R 1% 0402 SMD; Part Number: PASSIVE_792; Manufacturer 1: Vishay/Dale; Manufacturer Part Number 1: CRCW040282R0FKED; RSM: RC0402; PCB Footprint: SMD_0402; Part Type: Resistors\Fixed\SMD\0402\1%
R162 R164 R168 R169 = R_Dup5: RESIS.CHIP 150R 1% 0402 SMD; Part Number: PASSIVE_611; Manufacturer 1: YAGEO; Manufacturer Part Number 1: RC0402FR-07150RL; RSM: RC0402; PCB Footprint: SMD_0402; Part Type: Resistors\Fixed\SMD\0402\1%
R170-R173 = R_Dup5: RESIS.CHIP 130R 1% 0402 SMD; Part Number: PASSIVE_1444; Manufacturer 1: bourns; Manufacturer Part Number 1: CR0402-FX-1300GLF; RSM: RC0402; PCB Footprint: SMD_0402; Part Type: Resistors\Fixed\SMD\0402\1%
U1 = T2080: as U1 on sheet 07 SYS; TYPE: IC; MPN: T2080; Part Type: 32 BIT; Manufacturer Part Number 1: T2080NXN8PTB; Distributor 1: MOUSER(841-T2080NXN8PTB)
U21 = ICS859S0212I: 2:2 Differential-to-LVPECL/LVDS Clock Multiplexer; Part Number: LOGIC_351; Manufacturer 1: RENESAS; PCB Footprint: TSSOP-16; Part Type: CLOCK\GENERATOR; Manufacturer Part Number 1: 859S0212BGILF; Distributor 1: AVNET(859S0212BGILF); RSM: TSSOP-16

## Sheet 09A_USB_HUB.SchDoc
size 420 x 297 mm
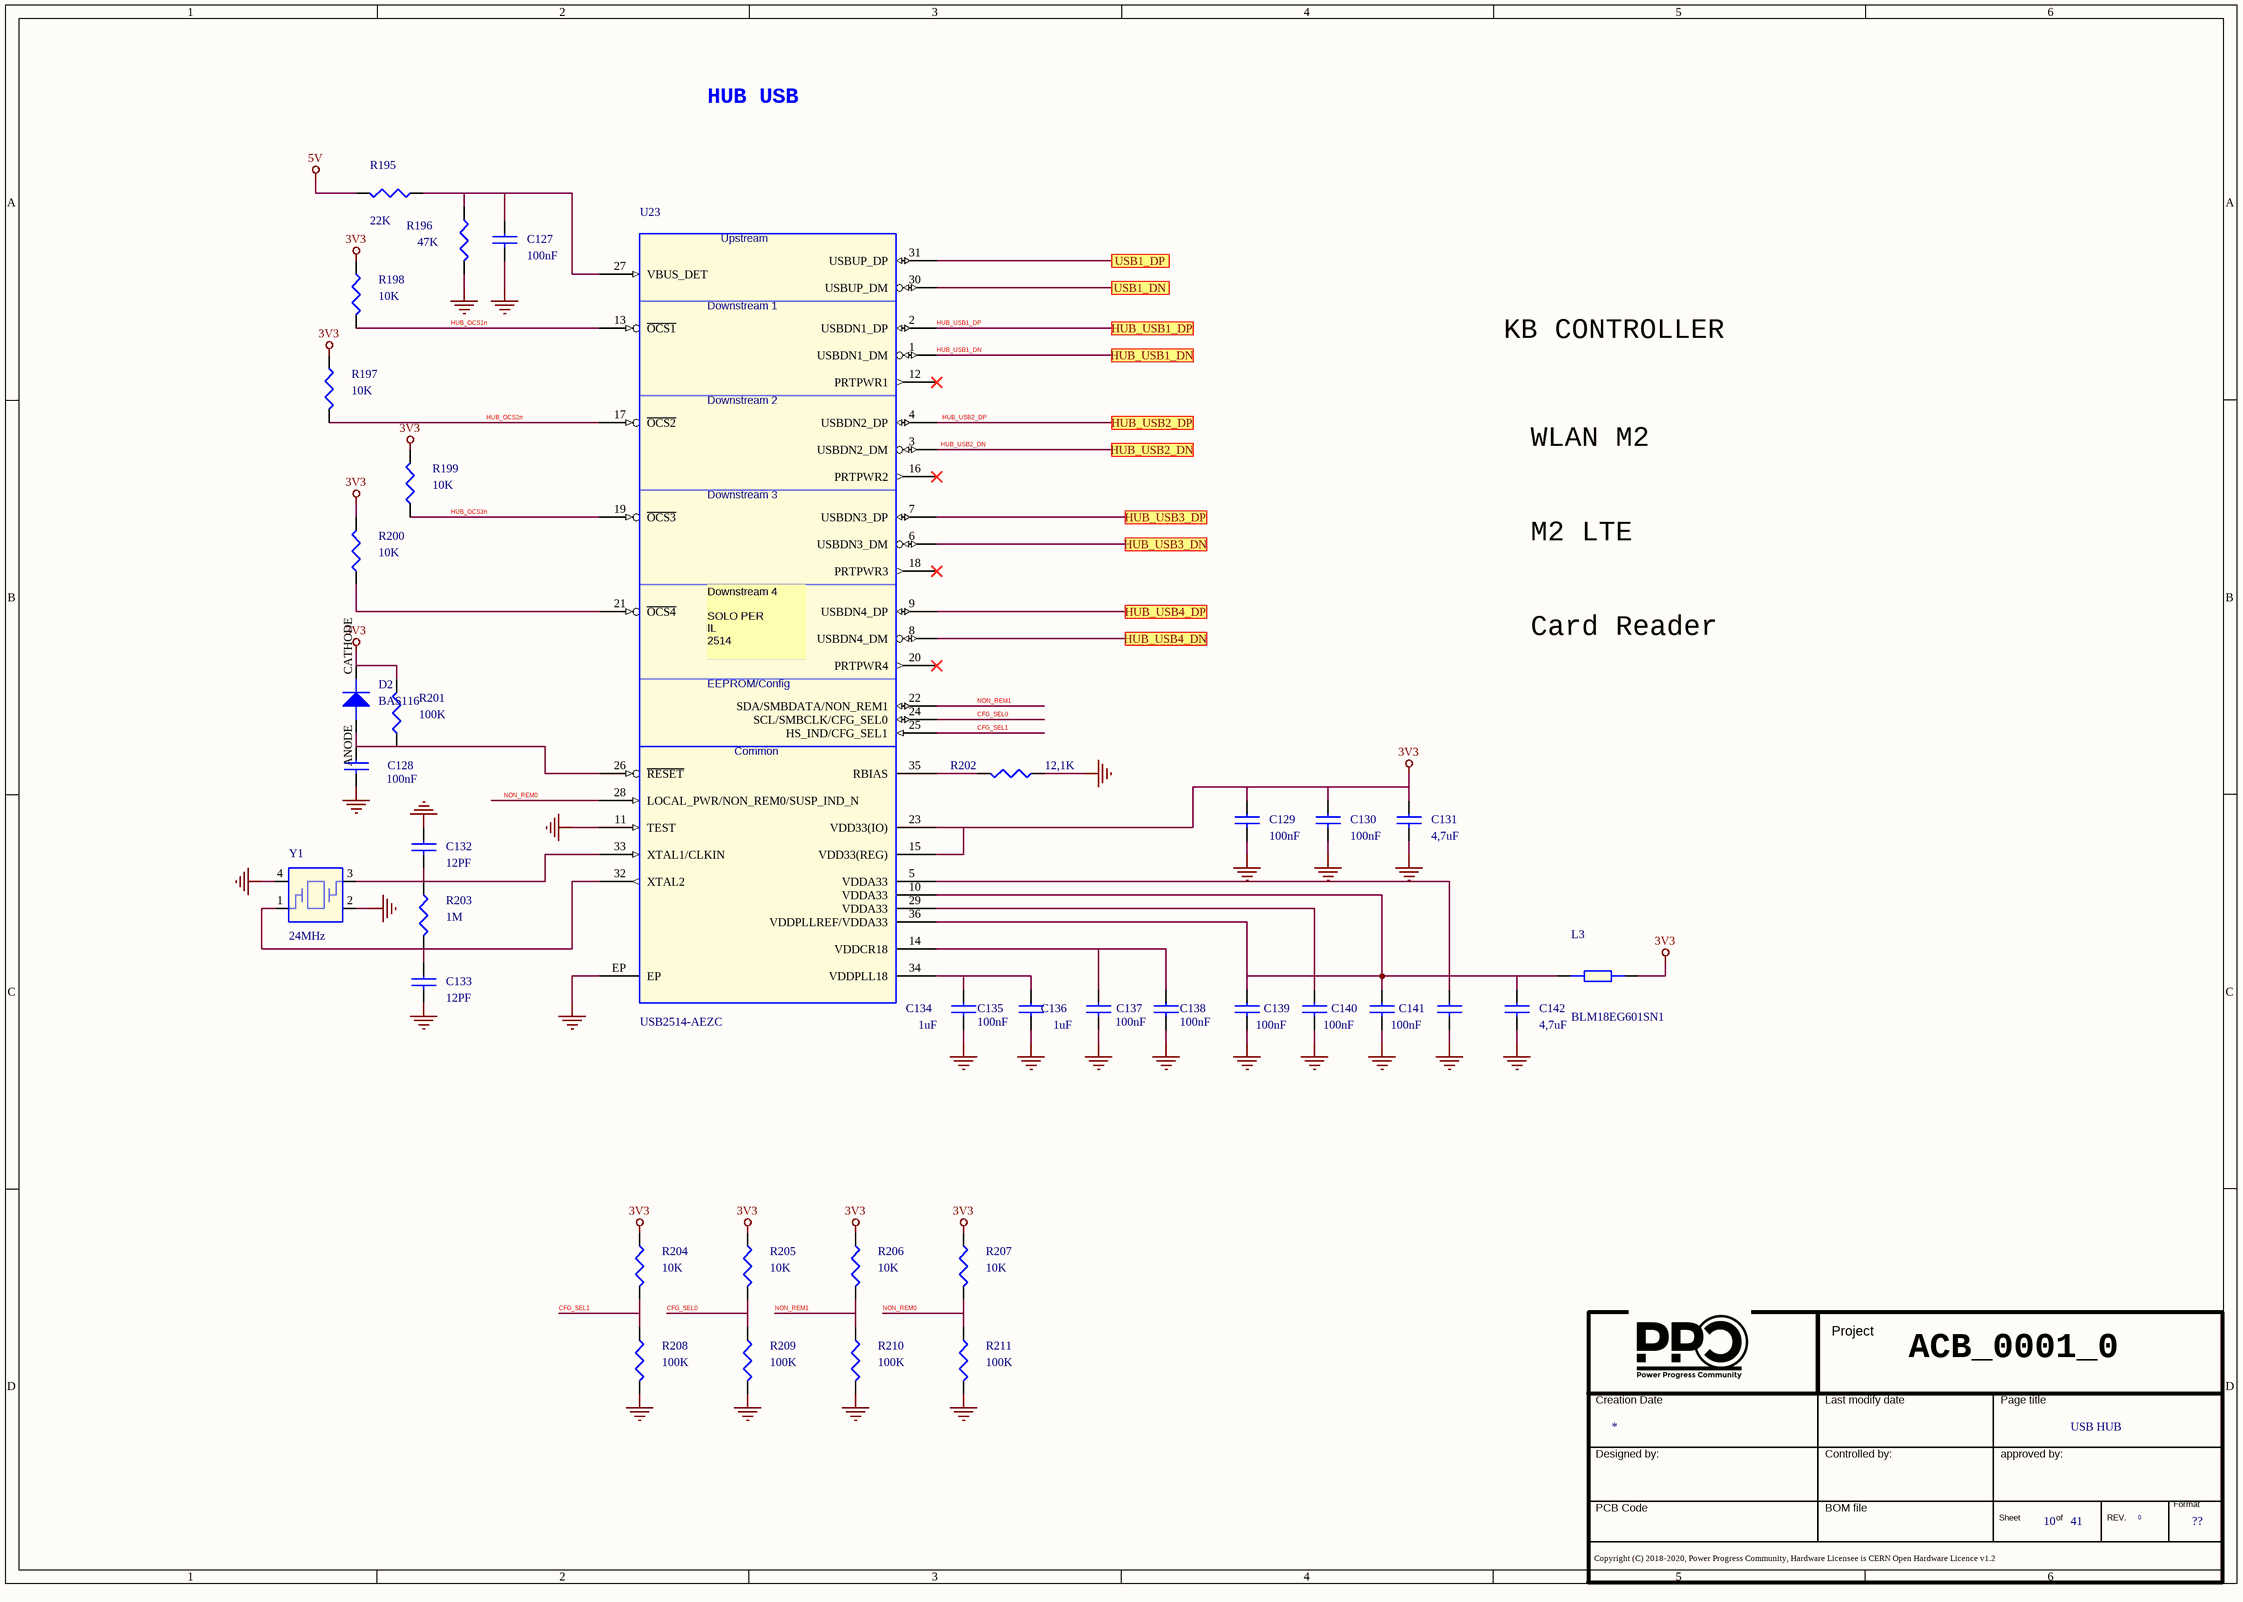
[diagram p17: 09A_USB_HUB.SchDoc]

### Parts
(Parts that share a designator on the sheet are numbered #1, #2 ... from top to bottom, then left to right.)
*#10  Doc: USB HUB  Page Count: 41  Page Number: 10  Page Size: ??  RevCode: 0  (hidden comment: Title_block_PPC)  (graphical)
C127  100nF  [SMD_0402]
C128  100nF  [SMD_0402]
C129  100nF  [SMD_0402]
C130  100nF  [SMD_0402]
C131  4,7uF  [SMD_0603]
C132  12PF  [SMD_0402]
C133  12PF  [SMD_0402]
C134  1uF  [SMD_0402]
C135  100nF  [SMD_0402]
C136  1uF  [SMD_0402]
C137  100nF  [SMD_0402]
C138  100nF  [SMD_0402]
C139  100nF  [SMD_0402]
C140  100nF  [SMD_0402]
C141  100nF  [SMD_0402]
C142  4,7uF  [SMD_0603]
D2  BAS116  [sod123]
L3  BLM18EG601SN1  [SMD_0603]
R195  22K  [SMD_0402]
R196  47K  [SMD_0402]
R197  10K  [SMD_0402]
R198  10K  [SMD_0402]
R199  10K  [SMD_0402]
R200  10K  [SMD_0402]
R201  100K  [SMD_0402]
R202  12,1K  [SMD_0402]
R203  1M  [SMD_0402]
R204  10K  [SMD_0402]
R205  10K  [SMD_0402]
R206  10K  [SMD_0402]
R207  10K  [SMD_0402]
R208  100K  [SMD_0402]
R209  100K  [SMD_0402]
R210  100K  [SMD_0402]
R211  100K  [SMD_0402]
U23  USB2514-AEZC  [QFN36]
Y1  24MHz  [SMD_2.5x3.2]

### Ports
HUB_USB1_DN, HUB_USB1_DP, HUB_USB2_DN, HUB_USB2_DP, HUB_USB3_DN, HUB_USB3_DP, HUB_USB4_DN, HUB_USB4_DP, USB1_DN, USB1_DP

### Nets
3V3: C129.1 C130.1 C131.1 D2.CATHODE L3.2 R197.1 R198.1 R199.1 R200.1 R201.1 R204.1 R205.1 R206.1 R207.1 U23.15(VDD33(REG)) U23.23(VDD33(IO))
5V: R195.1
GND: C127.2 C128.2 C129.2 C130.2 C131.2 C132.1 C133.2 C134.2 C135.2 C136.2 C137.2 C138.2 C139.2 C140.2 C141.2 C142.2 R196.1 R202.2 R208.2 R209.2 R210.2 R211.2 U23.11(TEST) U23.EP Y1.2 Y1.4
CFG_SEL0: R205.2 R209.1 U23.24(SCL/SMBCLK/CFG_SEL0)
CFG_SEL1: R204.2 R208.1 U23.25(HS_IND/CFG_SEL1)
HUB_OCS1n: R198.2 U23.13(~{OCS1})
HUB_OCS2n: R197.2 U23.17(~{OCS2})
HUB_OCS3n: R199.2 U23.19(~{OCS3})
HUB_USB1_DN: U23.1(USBDN1_DM) ; port HUB_USB1_DN
HUB_USB1_DP: U23.2(USBDN1_DP) ; port HUB_USB1_DP
HUB_USB2_DN: U23.3(USBDN2_DM) ; port HUB_USB2_DN
HUB_USB2_DP: U23.4(USBDN2_DP) ; port HUB_USB2_DP
NON_REM0: R207.2 R211.1 U23.28(LOCAL_PWR/NON_REM0/SUSP_IND_N)
NON_REM1: R206.2 R210.1 U23.22(SDA/SMBDATA/NON_REM1)
USB1_DM: U23.30(USBUP_DM) ; port USB1_DN
USB1_DP: U23.31(USBUP_DP) ; port USB1_DP
NetC127_1: C127.1 R195.2 R196.2 U23.27(VBUS_DET)
NetC128_1: C128.1 D2.ANODE R201.2 U23.26(~{RESET})
NetC132_2: C132.2 R203.1 U23.33(XTAL1/CLKIN) Y1.3
NetC133_1: C133.1 R203.2 U23.32(XTAL2) Y1.1
NetC134_1: C134.1 C135.1 U23.34(VDDPLL18)
NetC136_1: C136.1 C137.1 U23.14(VDDCR18)
NetC138_1: C138.1 C139.1 C140.1 C141.1 C142.1 L3.1 U23.5(VDDA33) U23.10(VDDA33) U23.29(VDDA33) U23.36(VDDPLLREF/VDDA33)
NetFL10_1: U23.8(USBDN4_DM) ; port HUB_USB4_DN
NetFL10_4: U23.9(USBDN4_DP) ; port HUB_USB4_DP
NetFL12_1: U23.6(USBDN3_DM) ; port HUB_USB3_DN
NetFL12_4: U23.7(USBDN3_DP) ; port HUB_USB3_DP
NetR200_2: R200.2 U23.21(~{OCS4})
NetR202_1: R202.1 U23.35(RBIAS)

Not connected (* = marked no-connect by the designer): U23 12(PRTPWR1)* 16(PRTPWR2)* 18(PRTPWR3)* 20(PRTPWR4)*

### Notes on the sheet
- HUB USB
- KB CONTROLLER
- WLAN M2
- M2 LTE
- Card Reader
- ACB_0001_0
- (in symbol USB2513_QFN36_0) Upstream; Downstream 1; Downstream 2; Downstream 3; Downstream 4 / SOLO PER / IL / 2514; EEPROM/Config; Common

### Library data of the parts
*#10 = Title_block_PPC: Title: T2080PCIe; Schematic Page Count: 45; Schematic Page Number: 11; Author: MICETEK; Page Create Date: March  8, 1995; Page Title: ?; Page Modify Date: *
C127 C129 C130 C135 C139-C141 = CAP NP_Dup4: COND.CER. 100NF 50V 0402 X7R SMD; Part Number: PASSIVE_24; Manufacturer 1: TDK; Manufacturer Part Number 1: CGA2B3X7R1H104M050BD; RSM: RC0402; TECNO77: C0402; PCB Footprint: SMD_0402; Part Type: Capacitors\Ceramic\SMD\0402; Distributor 1: MURATA ELETTRONICA SPA
C128 C137 C138 = CAP NP_Dup4: COND.CER. 100NF 50V 0402 X7R SMD; Manufacturer Part Number 1: CGA2B3X7R1H104M050BD; Manufacturer 1: TDK; Part Number: PASSIVE_24; RSM: RC0402; TECNO77: C0402; PCB Footprint: SMD_0402; Distributor 1: MURATA ELETTRONICA SPA; Part Type: Capacitors\Ceramic\SMD\0402
C131 = CAP NP_Dup4: COND.CER.4,7uF 16V X5R 0603 SMD; Manufacturer Part Number 1: CL10A475KO8NNNC; Manufacturer 1: SAMSUNG; Part Number: PASSIVE_1405; RSM: RC0603; TECNO77: C0603; PCB Footprint: SMD_0603; Distributor 1: DIGIKEY (490-3302-1-ND); Part Type: Capacitors\Ceramic\SMD\0603
C132 = CAP NP_Dup4: COND.CER.12PF 50V 0402 NPO/COG SMD; Manufacturer Part Number 1: GRM1555C1H120JZ01D; Manufacturer 1: Murata; Part Number: PASSIVE_36; RSM: RC0402; TECNO77: C0402; PCB Footprint: SMD_0402; Distributor 1: MURATA ELETTRONICA SPA; Part Type: Capacitors\Ceramic\SMD\0402
C133 = CAP NP_Dup4: COND.CER.12PF 50V 0402 NPO/COG SMD; Part Number: PASSIVE_36; Manufacturer 1: Murata; Manufacturer Part Number 1: GRM1555C1H120JZ01D; RSM: RC0402; TECNO77: C0402; PCB Footprint: SMD_0402; Part Type: Capacitors\Ceramic\SMD\0402; Distributor 1: MURATA ELETTRONICA SPA
C134 C136 = CAP NP_Dup2: CAP CER 1UF 25V X6S 0402; Part Number: PASSIVE_1446; Manufacturer 1: Murata; Manufacturer Part Number 1: GRM155C81E105KE11D; RSM: RC0402; PCB Footprint: SMD_0402; Part Type: Capacitors\Ceramic\SMD\0402
C142 = CAP NP_Dup4: COND.CER.4,7uF 16V X5R 0603 SMD; Part Number: PASSIVE_1405; Manufacturer 1: SAMSUNG; Manufacturer Part Number 1: CL10A475KO8NNNC; RSM: RC0603; TECNO77: C0603; PCB Footprint: SMD_0603; Part Type: Capacitors\Ceramic\SMD\0603; Distributor 1: DIGIKEY (490-3302-1-ND)
D2 = DIODE: DIODO, ALTA VELOCITÀ, SOD123; Manufacturer Part Number 1: BAS116H,115; Manufacturer 1: NXP; Part Number: DISCRETE_54; RSM: SOD123-AK; Distributor 1: FARNELL(2319131); PCB Footprint: sod123; Part Type: Diodes\Rectifiers
L3 = FERRITE_BEAD: FERRITE BEAD 600ohm 500mA 0603 SMD; Manufacturer Part Number 1: BLM18EG601SN1 SMD; Manufacturer 1: Murata; Part Number: PASSIVE_377; RSM: RC0603; PCB Footprint: SMD_0603; Part Type: Ferrite Beads\SMD\0603
R195 = R_Dup4: RESIS.CHIP 22K 5% 0402 SMD; Manufacturer 1: ROYAL OHM; Part Number: PASSIVE_843; TECNO77: R0402; RSM: RC0402; PCB Footprint: SMD_0402; Distributor 1: CAMEL ELETTRONICA SRL  #; Manufacturer Part Number 1: RESIS.CHIP 22K 5% 0402 SMD; Part Type: Resistors\Fixed\SMD\0402\5%
R196 = R_Dup6: RESIS.CHIP 47K 1% 0402 SMD; Part Number: PASSIVE_737; Manufacturer 1: ROYAL OHM; TECNO77: R0402; RSM: RC0402; PCB Footprint: SMD_0402; Part Type: Resistors\Fixed\SMD\0402\1%; Manufacturer Part Number 1: RESIS.CHIP 47K 1% 0402 SMD; Distributor 1: CAMEL ELETTRONICA SRL  #
R197-R200 R204-R207 = R_Dup5: as R114 on sheet 07 SYS; Manufacturer Part Number 1: RESIS.CHIP 10K 1% 0402 SMD; PCB Footprint: SMD_0402; Part Type: Resistors\Fixed\SMD\0402\1%
R201 R208-R211 = R_Dup5: RESIS.CHIP 100K 5% 0402 SMD; Manufacturer 1: ROYAL OHM; Part Number: PASSIVE_813; RSM: RC0402; Manufacturer Part Number 1: RESIS.CHIP 100K 5% 0402 SMD; PCB Footprint: SMD_0402; Part Type: Resistors\Fixed\SMD\0402\5%
R202 = R_Dup6: RESIS.CHIP 12,1K 1% 0402 SMD; Manufacturer 1: ROYAL OHM; Part Number: PASSIVE_590; TECNO77: R0402; RSM: RC0402; PCB Footprint: SMD_0402; Distributor 1: CAMEL ELETTRONICA SRL  #; Manufacturer Part Number 1: RESIS.CHIP 12,1K 1% 0402 SMD; Part Type: Resistors\Fixed\SMD\0402\1%
R203 = R_Dup6: RESIS.CHIP 1M 1% 0402 SMD; Part Number: PASSIVE_630; Manufacturer 1: ROYAL OHM; Manufacturer Part Number 1: RESIS.1M 1% 0402 SMD; TECNO77: R0402; RSM: RC0402; PCB Footprint: SMD_0402; Part Type: Resistors\Fixed\SMD\0402\1%; Distributor 1: CAMEL ELETTRONICA SRL  #
U23 = USB2513_QFN36_0: IC USB 2.0 4PORT HUB CTLR 64QFN; Part Number: LOGIC_286; Manufacturer 1: MICROCHIP; Manufacturer Part Number 1: USB2514B-AEZC; RSM: QFN-36-6X6-EP; TECNO77: QFN36-6X6-P0.5; Part Type: USB\HUB; Distributor 1: DIGIKEY(886-USB2514B-AEZC); PCB Footprint: QFN36
Y1 = CRYSTAL_4P_Dup1: CRYSTAL 24MHZ 10PF SMD; Part Number: MISC_160; Manufacturer 1: CTS; Manufacturer Part Number 1: 403C11A24M00000; TECNO77: OSC4P2.2(3.2X2.5)_SMT; RSM: XC-CTS-632; PCB Footprint: SMD_2.5x3.2; Part Type: Quartz; Distributor 1: DIGIKEY(CTX849CT-ND)

## Sheet 09B KEYBOARD.SchDoc
size 420 x 297 mm
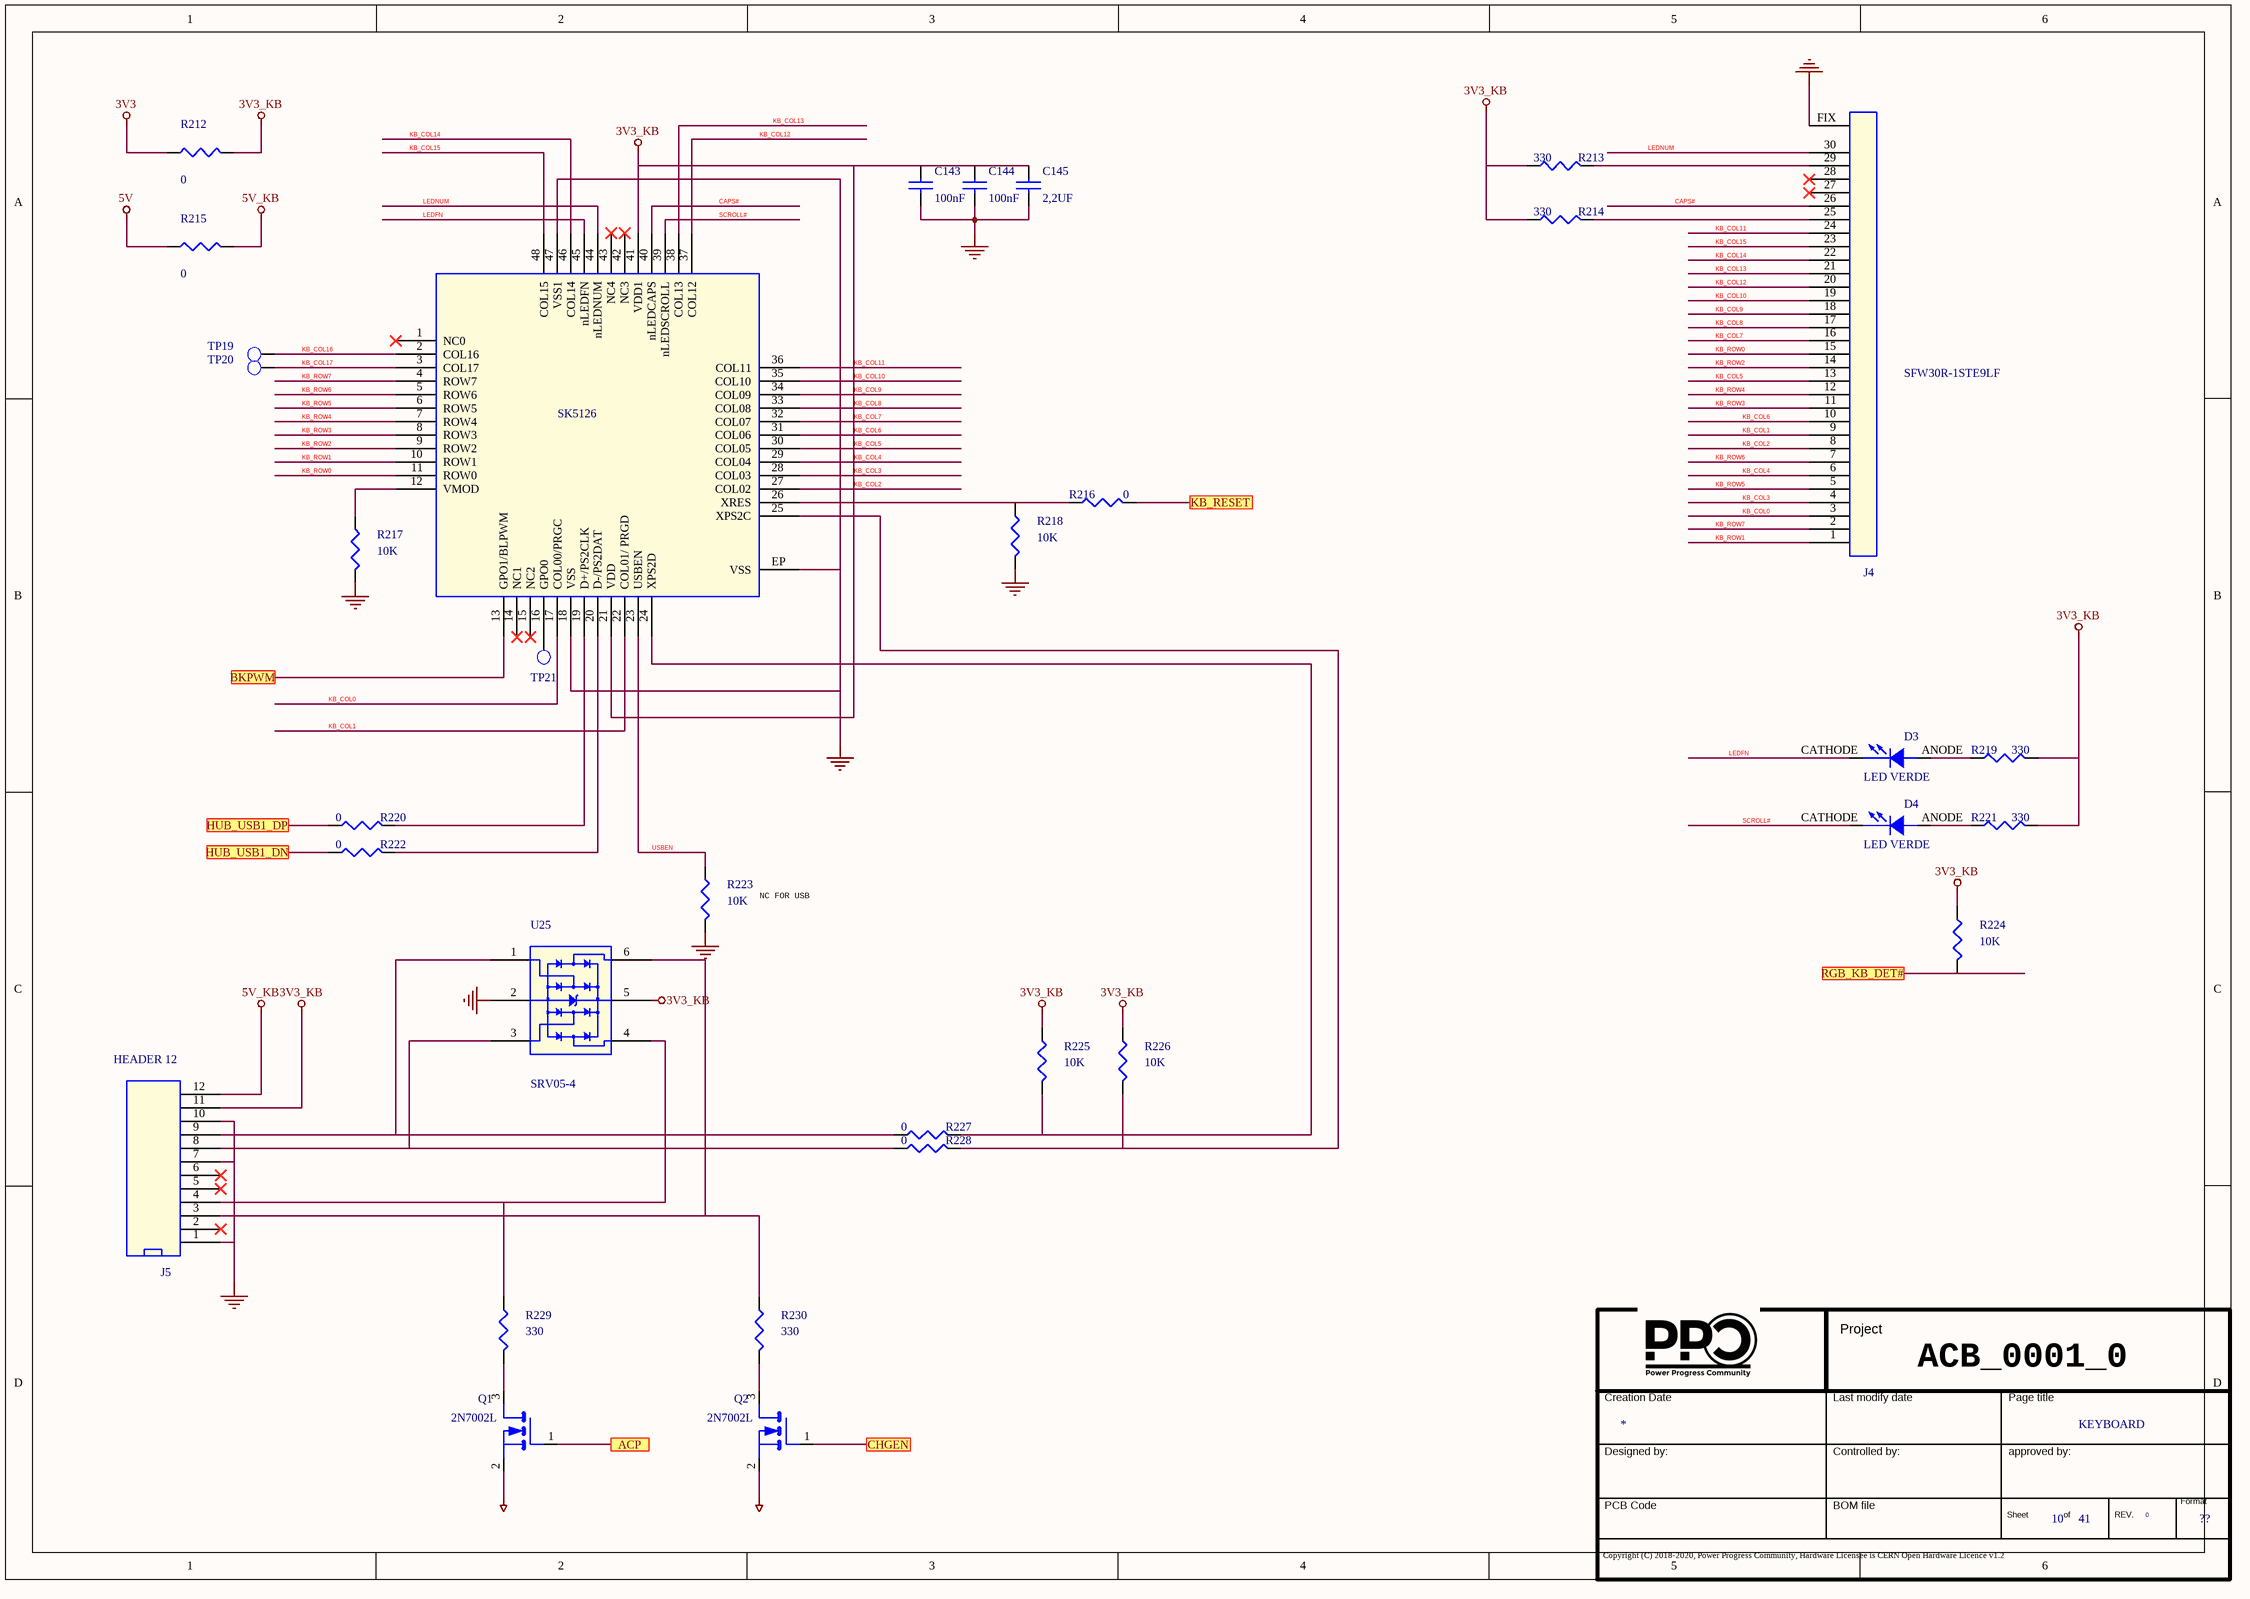
[diagram p18: 09B KEYBOARD.SchDoc]

### Parts
(Parts that share a designator on the sheet are numbered #1, #2 ... from top to bottom, then left to right.)
*#11  Doc: KEYBOARD  Page Count: 41  Page Number: 10  Page Size: ??  RevCode: 0  (hidden comment: Title_block_PPC)  (graphical)
C143  100nF  [SMD_0402]
C144  100nF  [SMD_0402]
C145  2,2UF  [SMD_0402]
D3  LED VERDE  [SMD_0603]
D4  LED VERDE  [SMD_0603]
J4  SFW30R-1STE9LF  [30 PIN PASSO 1mm]
J5  HEADER 12  [SMD_2X50_P=0.635mm]
Q1  2N7002L  [SOT23]
Q2  2N7002L  [SOT23]
R212  0  [SMD_0402]
R213  330  [SMD_0603]
R214  330  [SMD_0603]
R215  0  [SMD_0402]
R216  0  [SMD_0402]
R217  10K  [SMD_0402]
R218  10K  [SMD_0402]
R219  330  [SMD_0603]
R220  0  [SMD_0402]
R221  330  [SMD_0603]
R222  0  [SMD_0402]
R223  10K  [SMD_0402]
R224  10K  [SMD_0402]
R225  10K  [SMD_0402]
R226  10K  [SMD_0402]
R227  0  [SMD_0402]
R228  0  [SMD_0402]
R229  330  [SMD_0402]
R230  330  [SMD_0402]
TP19  TEST POINT  [PCB]  (value not drawn)
TP20  TEST POINT  [PCB]  (value not drawn)
TP21  TEST POINT  [PCB]  (value not drawn)
U24  SK5126  [QFN-48-EP]
U25  SRV05-4  [SOT23-6]

### Ports
ACP, BKPWM, CHGEN, HUB_USB1_DN, HUB_USB1_DP, KB_RESET, RGB_KB_DET#

### Nets
3V3: R212.1
5V: R215.1
5V_KB: J5.12 R215.2
GND: C143.2 C144.2 C145.2 J4.FIX J5.1 J5.7 J5.10 Q1.2 Q2.2 R217.2 R218.2 R223.2 U24.18(VSS) U24.47(VSS1) U24.EP(VSS) U25.2(GND)
KB_COL10: C143.1 C144.1 C145.1 J4.4 J4.6 J4.8 J4.10 J4.13 J4.16 J4.17 J4.18 J4.19 J4.24 J5.11 R212.2 R213.2 R214.2 R219.2 R221.2 R224.1 R225.1 R226.1 U24.21(VDD) U24.27(COL02) U24.28(COL03) U24.29(COL04) U24.30(COL05) U24.31(COL06) U24.32(COL07) U24.33(COL08) U24.34(COL09) U24.35(COL10) U24.36(COL11) U24.41(VDD1) U25.5(VCC)  [also labelled 3V3_KB, KB_COL11, KB_COL2, KB_COL3, KB_COL4, KB_COL5, KB_COL6, KB_COL7, KB_COL8, KB_COL9]
ACP: Q1.1 ; port ACP
CAPS#: J4.26 U24.40(nLEDCAPS)
CHGEN: Q2.1 ; port CHGEN
HUB_USB1_DN: R222.2 ; port HUB_USB1_DN
HUB_USB1_DP: R220.2 ; port HUB_USB1_DP
KB_COL0: J4.3 U24.17(COL00/PRGC)
KB_COL1: J4.9 U24.22(COL01/_PRGD)
KB_COL12: J4.20 U24.37(COL12)
KB_COL13: J4.21 U24.38(COL13)
KB_COL14: J4.22 U24.46(COL14)
KB_COL15: J4.23 U24.48(COL15)
KB_COL16: TP19.1(TP) U24.2(COL16)
KB_COL17: TP20.1(TP) U24.3(COL17)
KB_ROW0: J4.15 U24.11(ROW0)
KB_ROW1: J4.1 U24.10(ROW1)
KB_ROW2: J4.14 U24.9(ROW2)
KB_ROW3: J4.11 U24.8(ROW3)
KB_ROW4: J4.12 U24.7(ROW4)
KB_ROW5: J4.5 U24.6(ROW5)
KB_ROW6: J4.7 U24.5(ROW6)
KB_ROW7: J4.2 U24.4(ROW7)
LEDFN: D3.CATHODE U24.45(nLEDFN)
LEDNUM: J4.30 U24.44(nLEDNUM)
SCROLL#: D4.CATHODE U24.39(nLEDSCROLL)
USBEN: R223.1 U24.23(USBEN)
NetD3_ANODE: D3.ANODE R219.1
NetD4_ANODE: D4.ANODE R221.1
NetJ4_25: J4.25 R214.1
NetJ4_29: J4.29 R213.1
NetJ5_3: J5.3 R230.2 U25.6(I/O6)
NetJ5_4: J5.4 R229.2 U25.4(I/O4)
NetJ5_8: J5.8 R228.2 U25.3(I/O3)
NetJ5_9: J5.9 R227.2 U25.1(I/O1)
NetQ1_3: Q1.3 R229.1
NetQ2_3: Q2.3 R230.1
NetR216_1: R216.1 R218.1 U24.26(XRES)
NetR216_2: R216.2 ; port KB_RESET
NetR217_1: R217.1 U24.12(VMOD)
NetR220_1: R220.1 U24.19(D+/PS2CLK)
NetR222_1: R222.1 U24.20(D-/PS2DAT)
NetR224_2: R224.2 ; port RGB_KB_DET#
NetR225_2: R225.2 R227.1 U24.24(XPS2D)
NetR226_2: R226.2 R228.1 U24.25(XPS2C)
NetR309_2: U24.13(GPO1/BLPWM) ; port BKPWM
NetTP21_1: TP21.1(TP) U24.16(GPO0)

Not connected (* = marked no-connect by the designer): J4 27* 28*; J5 2* 5* 6*; U24 1(NC0)* 14(NC1)* 15(NC2)* 42(NC3)* 43(NC4)*

### Notes on the sheet
- NC FOR USB
- ACB_0001_0

### Library data of the parts
*#11 = Title_block_PPC: Title: T2080PCIe; Schematic Page Count: 45; Schematic Page Number: 12; Author: MICETEK; Page Create Date: March  8, 1995; Page Title: ?; Page Modify Date: *
C143 C144 = CAP NP_Dup9: COND.CER. 100NF 50V 0402 X7R SMD; Part Number: PASSIVE_24; Manufacturer 1: TDK; Manufacturer Part Number 1: CGA2B3X7R1H104M050BD; RSM: RC0402; Part Type: Capacitors\Ceramic\SMD\0402; Distributor 1: MODULI ELETTRONICI E COMPONENTI spa; PCB Footprint: SMD_0402
C145 = CAP NP_Dup9: CAP CERAMIC 2.2UF 6.3V X5R 0402; Part Number: PASSIVE_55; Manufacturer 1: Panasonic - ECG; Manufacturer Part Number 1: ECJ-0EB0J225M; RSM: RC0402; Part Type: Capacitors\Ceramic\SMD\0402; Distributor 1: DIGIKEY (PCC2421TR-ND); PCB Footprint: SMD_0402
D3 = LED_2: LED CHIPLED VERDE 40mcd 570nm; Manufacturer Part Number 1: 598-8070-107F; Manufacturer 1: DIALIGHT; Part Number: DISCRETE_31; RSM: LED0603-AK; PCB Footprint: SMD_0603; Distributor 1: MOUSER(645-598-8070-107F); Part Type: Diodes\LED
D4 = LED_2: LED CHIPLED VERDE 40mcd 570nm; Part Number: DISCRETE_31; Manufacturer 1: DIALIGHT; Manufacturer Part Number 1: 598-8070-107F; RSM: LED0603-AK; PCB Footprint: SMD_0603; Part Type: Diodes\LED; Distributor 1: MOUSER(645-598-8070-107F)
J4 = CONN TRBLK 32_1: FFC e FPC 30P SIDE ENTRY SMT 1MM LOWER CONTACT; Manufacturer 1: AMPHENOL; Part Number: CONNECTORS_687; RSM: FCI-SFW30R; Distributor 1: MOUSER(649-SFW30R-1STE9LF); Manufacturer Part Number 1: SFW30R-1STE9LF; Part Type: ZIF; PCB Footprint: 30 PIN PASSO 1mm
J5 = HEADER_12X1: STRIP FEMM.1x12P CS.p=2.54mm SMT; PART NUMBER: CONNECTORS_358; Manufacturer 1: Samtec; Manufacturer Part Number 1: SSM-112-L-SV; RSM: PIN-100MLS-12; PCB Footprint: 12X1P=2.54mm SMT; Part Type: Strip\SOCKET; Distributor 1: DIGIKEY(SAM1148-12-ND )
Q1 Q2 = 2N7002: TRAN NMOS 60V 115MA SOT23; Part Number: DISCRETE_188; Manufacturer 1: ON SEMICONDUCTORS; Manufacturer Part Number 1: 2N7002LT1G; RSM: SOT-23; PCB Footprint: sot23; Part Type: Mosfet\SOT23; Distributor 1: DIGIKEY(2N7002LT3GOSCT-ND)
R212 R215 R220 R222 R227 R228 = R_Dup8: as R131 on sheet 07 SYS; Distributor 1: CAMEL ELETTRONICA SRL  #; Manufacturer Part Number 1: RESIS.CHIP 0R 5% 0402 SMD; Part Type: Resistors\Fixed\SMD\0402\5%; PCB Footprint: SMD_0402
R213 R214 R219 = R_Dup8: RESIS.CHIP 330R 5% 0603 1/10W SMD; Part Number: PASSIVE_1138; Manufacturer 1: NIC; Manufacturer Part Number 1: NRC06J331TRF; RSM: RC0603; Part Type: Resistors\Fixed\SMD\0603\5%; Distributor 1: MODULI ELETTRONICI E COMPONENTI spa; PCB Footprint: SMD_0603
R216 = R_Dup8: RESIS.CHIP 0R 5% 0402 SMD; Part Number: PASSIVE_805; Manufacturer 1: ROYAL OHM; RSM: RC0402; PCB Footprint: SMD_0402; Part Type: Resistors\Fixed\SMD\0402\5%; Manufacturer Part Number 1: RESIS.CHIP 0R 5% 0402 SMD; Distributor 1: CAMEL ELETTRONICA SRL  #
R217 R218 R223-R226 = R_Dup5: as R99 on sheet 07 SYS; Part Type: Resistors\Fixed\SMD\0402\1%; PCB Footprint: SMD_0402; Manufacturer Part Number 1: RESIS.CHIP 10K 1% 0402 SMD
R221 = R_Dup8: RESIS.CHIP 330R 5% 0603 1/10W SMD; Manufacturer Part Number 1: NRC06J331TRF; Manufacturer 1: NIC; Part Number: PASSIVE_1138; RSM: RC0603; Distributor 1: MODULI ELETTRONICI E COMPONENTI spa; Part Type: Resistors\Fixed\SMD\0603\5%; PCB Footprint: SMD_0603
R229 R230 = R_Dup5: RESIS.CHIP 330R 5% 0402 SMD; Manufacturer 1: ROYAL OHM; Part Number: PASSIVE_854; RSM: RC0402; Manufacturer Part Number 1: RESIS.CHIP 330R 5% 0402 SMD; PCB Footprint: SMD_0402; Part Type: Resistors\Fixed\SMD\0402\5%
TP19-TP21 = T POINT R: TEST POINT SU PCB; Part Number: CONNECTORS_542; RSM: AE-TESTPOINT; Part Type: Tpoint; PCB Footprint: PCB
U24 = SK5126_0: Industrial usb keyborad controller; Part Number: LOGIC_354; Manufacturer 1: Sprintek; Manufacturer Part Number 1: SK5126-LT / AP2191SG-13; PCB Footprint: QFN-48-EP; Part Type: USB\KEYBOARD; Distributor 1: SPRINGTEK; RSM: QFN-48-EP
U25 = SRV05-4: TVS Diode Array5VWM 17.5VC USB; Manufacturer Part Number 1: SRV05-4.TCT; Manufacturer 1: Semtec; Part Number: DISCRETE_246; CLASS: IC; RSM: SOT-23-6; PCB Footprint: SOT23-6; Distributor 1: DIGIKEY (SRV05-4CT-ND); Part Type: Protections

## Sheet 09C_KB_LED_AND_LED.SchDoc
size 420 x 297 mm
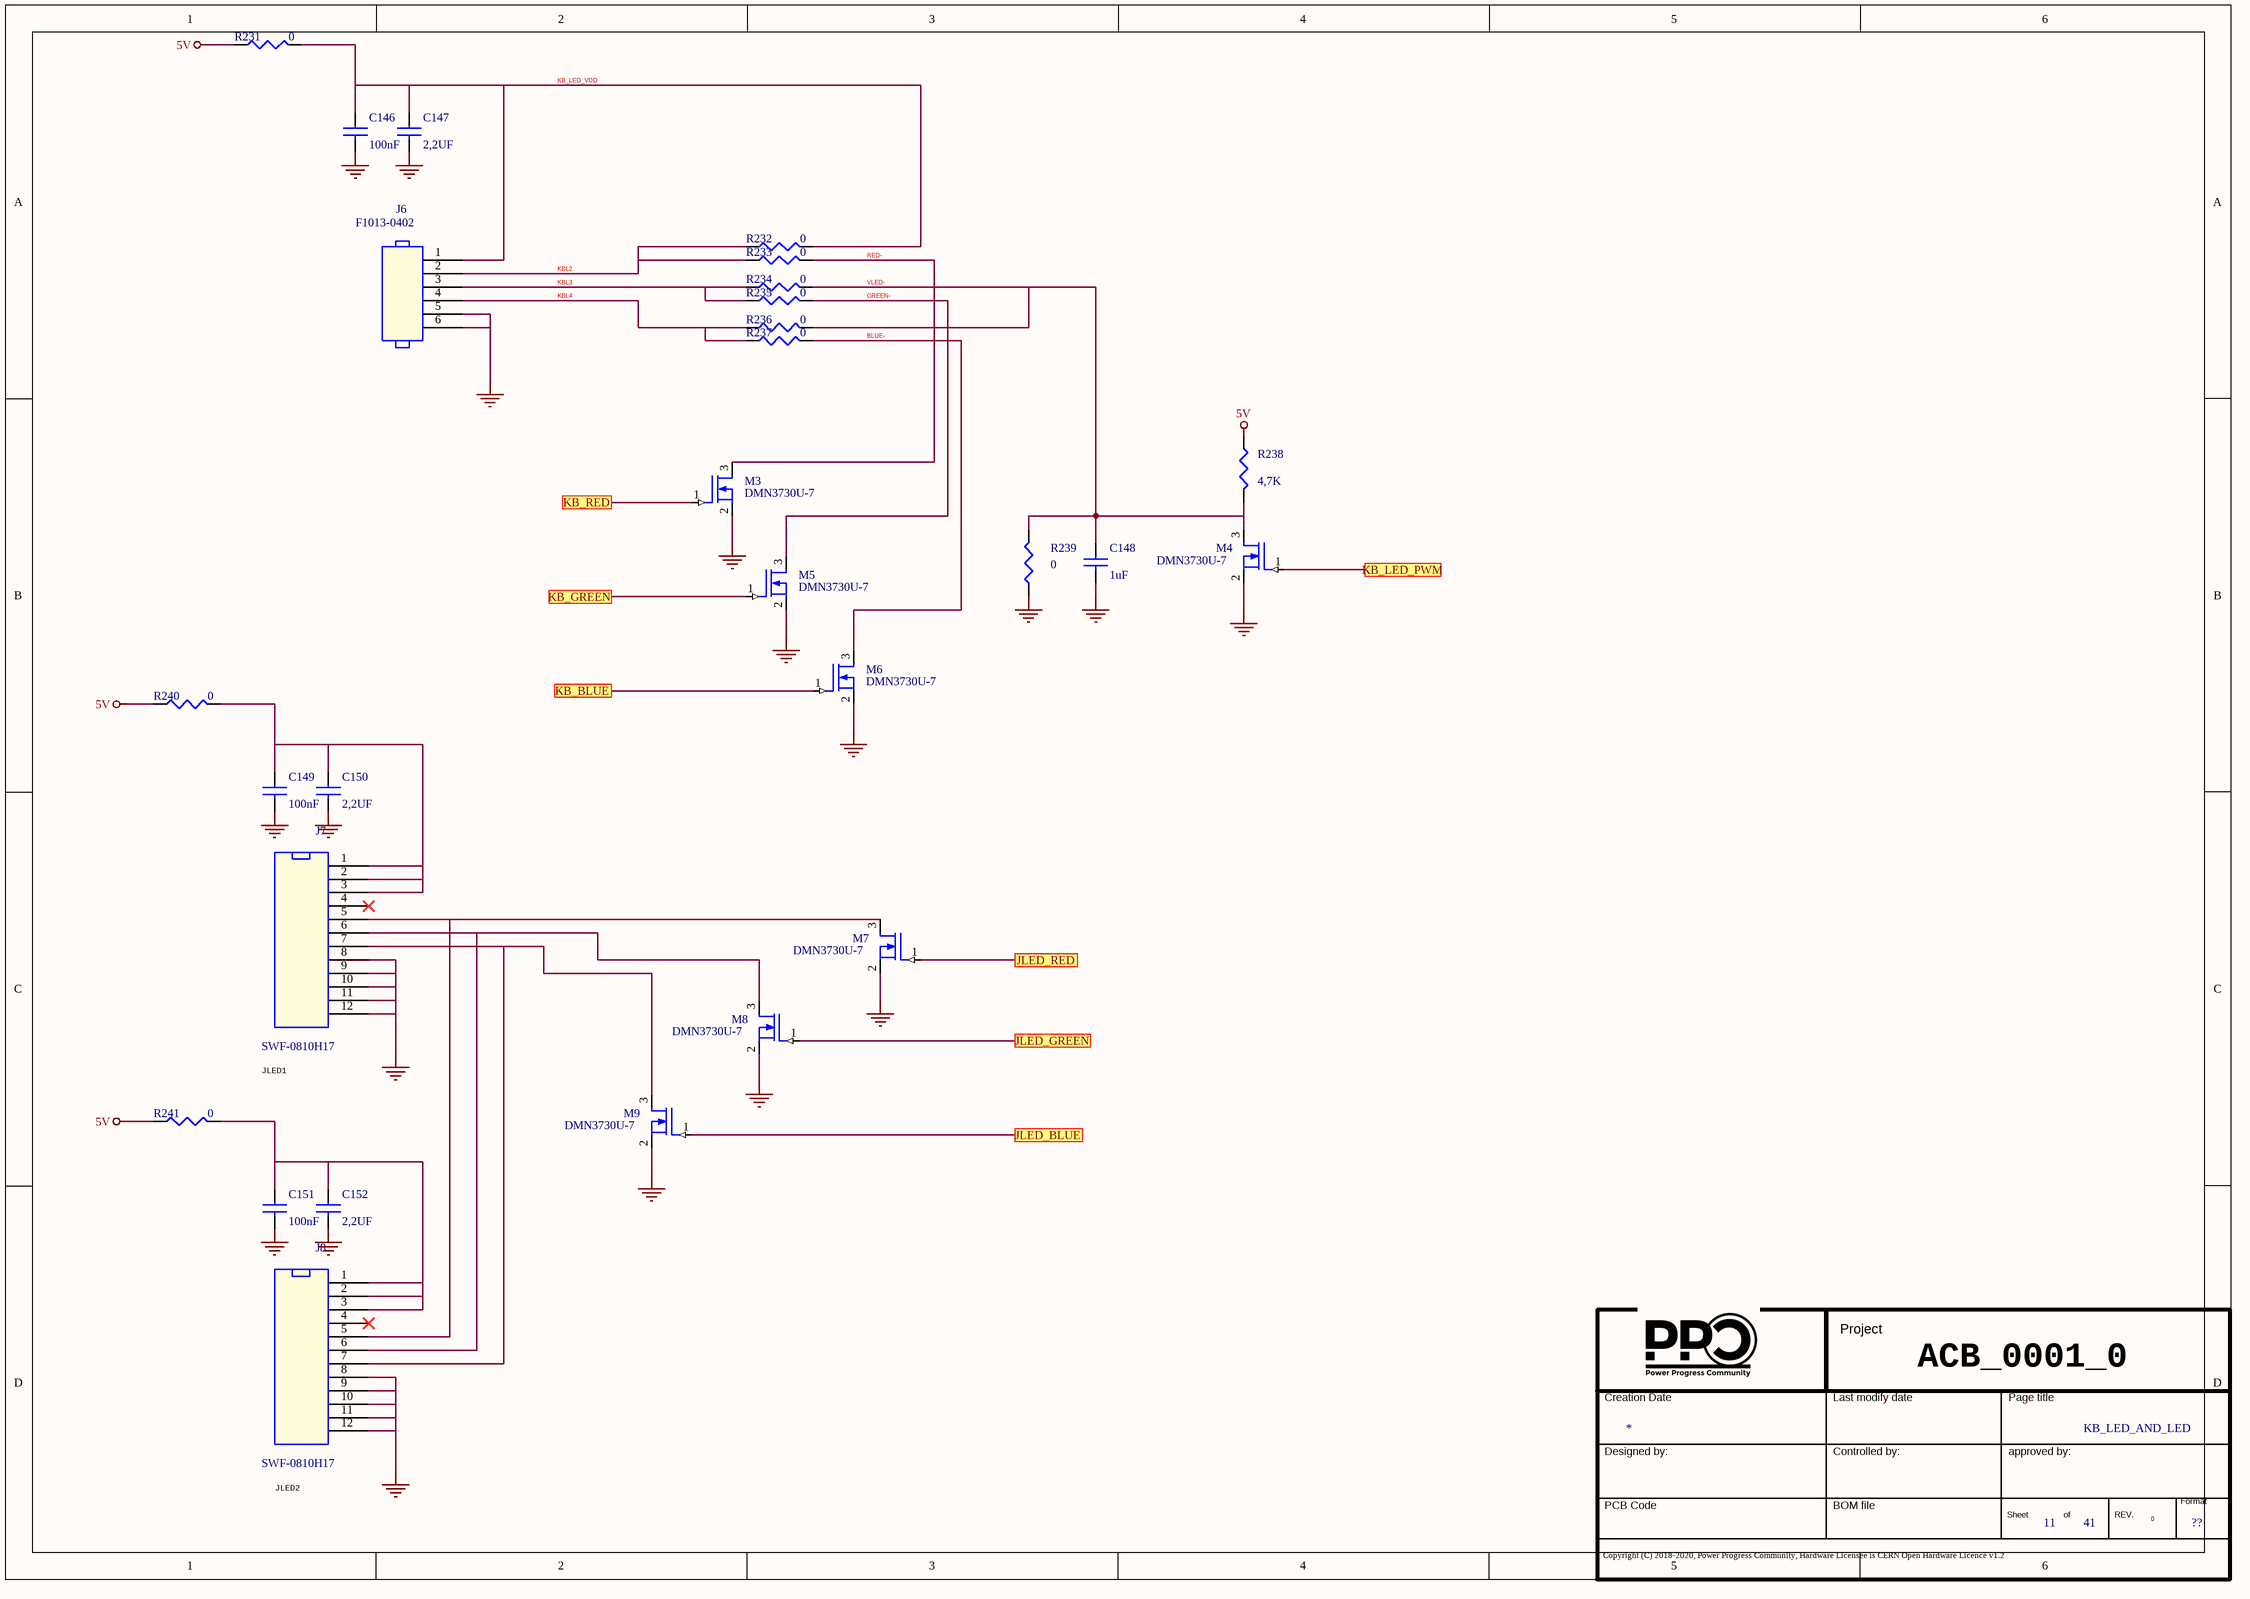
[diagram p19: 09C_KB_LED_AND_LED.SchDoc]

### Parts
(Parts that share a designator on the sheet are numbered #1, #2 ... from top to bottom, then left to right.)
*#12  Doc: KB_LED_AND_LED  Page Count: 41  Page Number: 11  Page Size: ??  RevCode: 0  (hidden comment: Title_block_PPC)  (graphical)
C146  100nF  [SMD_0402]
C147  2,2UF  [SMD_0402]
C148  1uF  [SMD_0402]
C149  100nF  [SMD_0402]
C150  2,2UF  [SMD_0402]
C151  100nF  [SMD_0402]
C152  2,2UF  [SMD_0402]
J6  F1013-0402  [PTH]
J7  SWF-0810H17  [SMD_2X50_P=0.635mm]
J8  SWF-0810H17  [SMD_2X50_P=0.635mm]
M3  DMN3730U-7  [sot23]
M4  DMN3730U-7  [sot23]
M5  DMN3730U-7  [sot23]
M6  DMN3730U-7  [sot23]
M7  DMN3730U-7  [sot23]
M8  DMN3730U-7  [sot23]
M9  DMN3730U-7  [sot23]
R231  0  [SMD_0402]
R232  0  [SMD_0402]
R233  0  [SMD_0402]
R234  0  [SMD_0402]
R235  0  [SMD_0402]
R236  0  [SMD_0402]
R237  0  [SMD_0402]
R238  4,7K  [SMD_0402]
R239  0  [SMD_0402]
R240  0  [SMD_0402]
R241  0  [SMD_0402]

### Ports
JLED_BLUE, JLED_GREEN, JLED_RED, KB_BLUE, KB_GREEN, KB_LED_PWM, KB_RED

### Nets
5V: R231.1 R238.1 R240.1 R241.1
GND: C146.2 C147.2 C148.2 C149.2 C150.2 C151.2 C152.2 J6.5 J6.6 J7.8 J7.9 J7.10 J7.11 J7.12 J8.8 J8.9 J8.10 J8.11 J8.12 M3.2(SOURCE) M4.2(SOURCE) M5.2(SOURCE) M6.2(SOURCE) M7.2(SOURCE) M8.2(SOURCE) M9.2(SOURCE) R239.1
BLUE-: M6.3(DRAIN) R237.2
GREEN-: M5.3(DRAIN) R235.2
KB_LED_VDD: C146.1 C147.1 J6.1 R231.2 R232.2
KBL2: J6.2 R232.1 R233.1
KBL3: J6.3 R234.1 R235.1
KBL4: J6.4 R236.1 R237.1
RED-: M3.3(DRAIN) R233.2
VLED-: C148.1 M4.3(DRAIN) R234.2 R236.2 R238.2 R239.2
NetC149_1: C149.1 C150.1 J7.1 J7.2 J7.3 R240.2
NetC151_1: C151.1 C152.1 J8.1 J8.2 J8.3 R241.2
NetJ7_5: J7.5 J8.5 M7.3(DRAIN)
NetJ7_6: J7.6 J8.6 M8.3(DRAIN)
NetJ7_7: J7.7 J8.7 M9.3(DRAIN)
NetM3_1: M3.1(GATE) ; port KB_RED
NetM4_1: M4.1(GATE) ; port KB_LED_PWM
NetM5_1: M5.1(GATE) ; port KB_GREEN
NetM6_1: M6.1(GATE) ; port KB_BLUE
NetM7_1: M7.1(GATE) ; port JLED_RED
NetM8_1: M8.1(GATE) ; port JLED_GREEN
NetM9_1: M9.1(GATE) ; port JLED_BLUE

Not connected (* = marked no-connect by the designer): J7 4*; J8 4*

### Notes on the sheet
- JLED1
- ACB_0001_0
- JLED2

### Library data of the parts
*#12 = Title_block_PPC: Title: T2080PCIe; Schematic Page Count: 45; Schematic Page Number: 13; Author: MICETEK; Page Create Date: March  8, 1995; Page Title: ?; Page Modify Date: *
C146 = CAP NP_Dup9: as C143 on sheet 09B KEYBOARD; PCB Footprint: SMD_0402; Part Type: Capacitors\Ceramic\SMD\0402; Distributor 1: MODULI ELETTRONICI E COMPONENTI spa
C147 = CAP NP_Dup9: as C145 on sheet 09B KEYBOARD; PCB Footprint: SMD_0402; Part Type: Capacitors\Ceramic\SMD\0402; Distributor 1: DIGIKEY (PCC2421TR-ND)
C148 = CAP NP_Dup2: CAP CER 1UF 6.3V 10% X5R 0402 AUTOMOTIVE; Part Number: PASSIVE_49; Manufacturer 1: Taiyo Yuden; Manufacturer Part Number 1: JMK105BJ105KVHF; RSM: RC0402; PCB Footprint: SMD_0402; Part Type: Capacitors\Ceramic\SMD\0402; Distributor 1: DIGIKEY (587-3766-1-ND)
C149 C151 = CAP NP_Dup9: COND.CER. 100NF 50V 0402 X7R SMD; Manufacturer Part Number 1: CGA2B3X7R1H104M050BD; Manufacturer 1: TDK; Part Number: PASSIVE_24; RSM: RC0402; PCB Footprint: SMD_0402; Distributor 1: MODULI ELETTRONICI E COMPONENTI spa; Part Type: Capacitors\Ceramic\SMD\0402
C150 C152 = CAP NP_Dup9: CAP CERAMIC 2.2UF 6.3V X5R 0402; Manufacturer Part Number 1: ECJ-0EB0J225M; Manufacturer 1: Panasonic - ECG; Part Number: PASSIVE_55; RSM: RC0402; PCB Footprint: SMD_0402; Distributor 1: DIGIKEY (PCC2421TR-ND); Part Type: Capacitors\Ceramic\SMD\0402
J6 = HEADER_6: STRIP MASC.1x6P CS.p=2.54mm; Part Number: CONNECTORS_462; Manufacturer 1: Samtec; Manufacturer Part Number 1: TSW-106-24-T-S; RSM: PIN-100MLS-6; PCB Footprint: PTH; Part Type: Strip\Terminal; Distributor 1: CLAITRON LASI SILVESTAR S.R.L.
J7 J8 = HEADER_12X1_Dup1: STRIP MASCH.1x12P CS.p=2.0mm SMT; PART NUMBER: CONNECTORS_498; Manufacturer 1: Samtec; Manufacturer Part Number 1: TMM-112-01-G-S; PCB Footprint: 12X1P=2.0mm SMT; RSM: PIN6-12-SMD; Part Type: Strip\Terminal; Distributor 1: FARNELL(1668553)
M3-M5 M8 M9 = NMOS_SOT23: DMN3730U-7 N 750mA 30V POWER MOS; Part Number: DISCRETE_305; Manufacturer 1: DIOES; RSM: SOT-23; PCB Footprint: sot23; Part Type: Mosfet\SOT23; Manufacturer Part Number 1: DMN3730U-7; Distributor 1: DIGIKEY(DMN3730U-7DICT-ND)
M6 M7 = NMOS_SOT23: DMN3730U-7 N 750mA 30V POWER MOS; Manufacturer 1: DIOES; Part Number: DISCRETE_305; RSM: SOT-23; PCB Footprint: sot23; Distributor 1: DIGIKEY(DMN3730U-7DICT-ND); Manufacturer Part Number 1: DMN3730U-7; Part Type: Mosfet\SOT23
R231 R239 = R_Dup8: as R131 on sheet 07 SYS; PCB Footprint: SMD_0402; Distributor 1: CAMEL ELETTRONICA SRL  #; Manufacturer Part Number 1: RESIS.CHIP 0R 5% 0402 SMD; Part Type: Resistors\Fixed\SMD\0402\5%
R232-R237 R240 R241 = R_Dup8: as R216 on sheet 09B KEYBOARD; PCB Footprint: SMD_0402; Part Type: Resistors\Fixed\SMD\0402\5%; Manufacturer Part Number 1: RESIS.CHIP 0R 5% 0402 SMD; Distributor 1: CAMEL ELETTRONICA SRL  #
R238 = R_Dup5: as R95 on sheet 07 SYS; PCB Footprint: SMD_0402; Distributor 1: CAMEL ELETTRONICA SRL  #; Manufacturer Part Number 1: RESIS.CHIP 4,7K 5% 0402 SMD; Part Type: Resistors\Fixed\SMD\0402\5%